# EAGLE schematic SLB_EXT_EAGLE (EAGLE 9.6.2), part 2 of 2
## Sheet 11 of 14: Equiv to Page 23 of 27 of Longboard_32bit_ext_Schematic_B9_FULL_PLACE.PDF
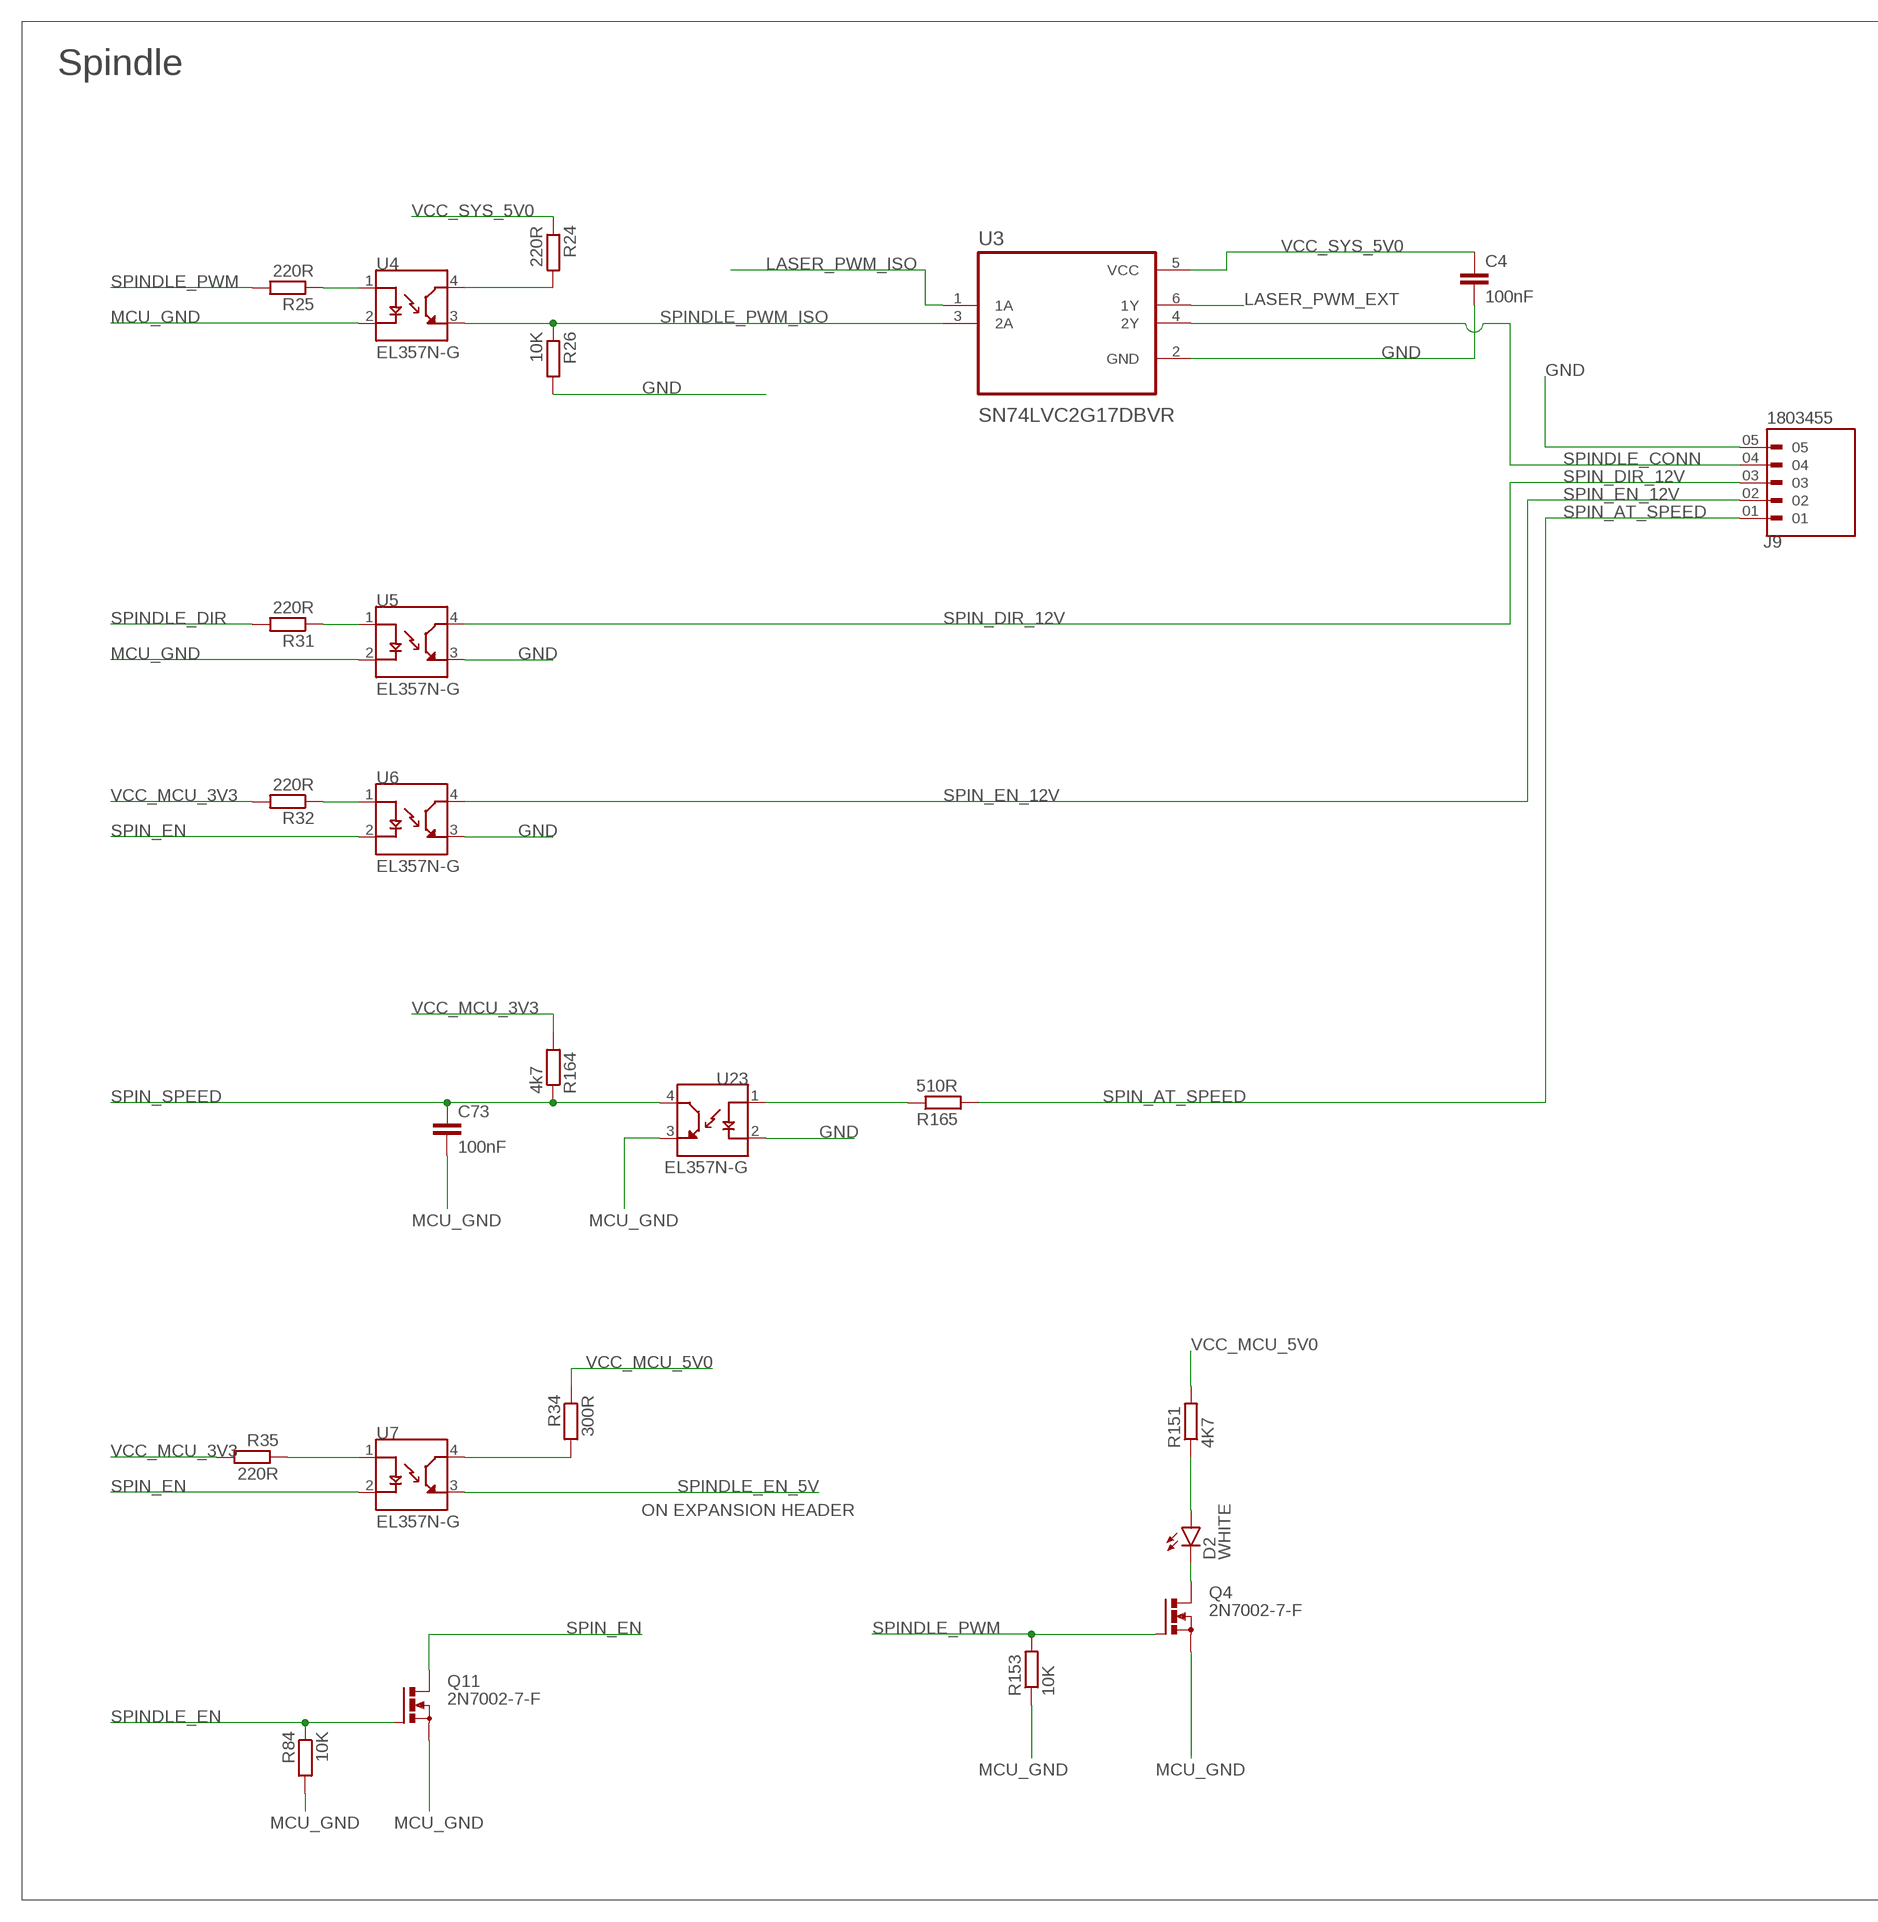
[diagram p12: schematic, sheet 11, part 1 of 2]
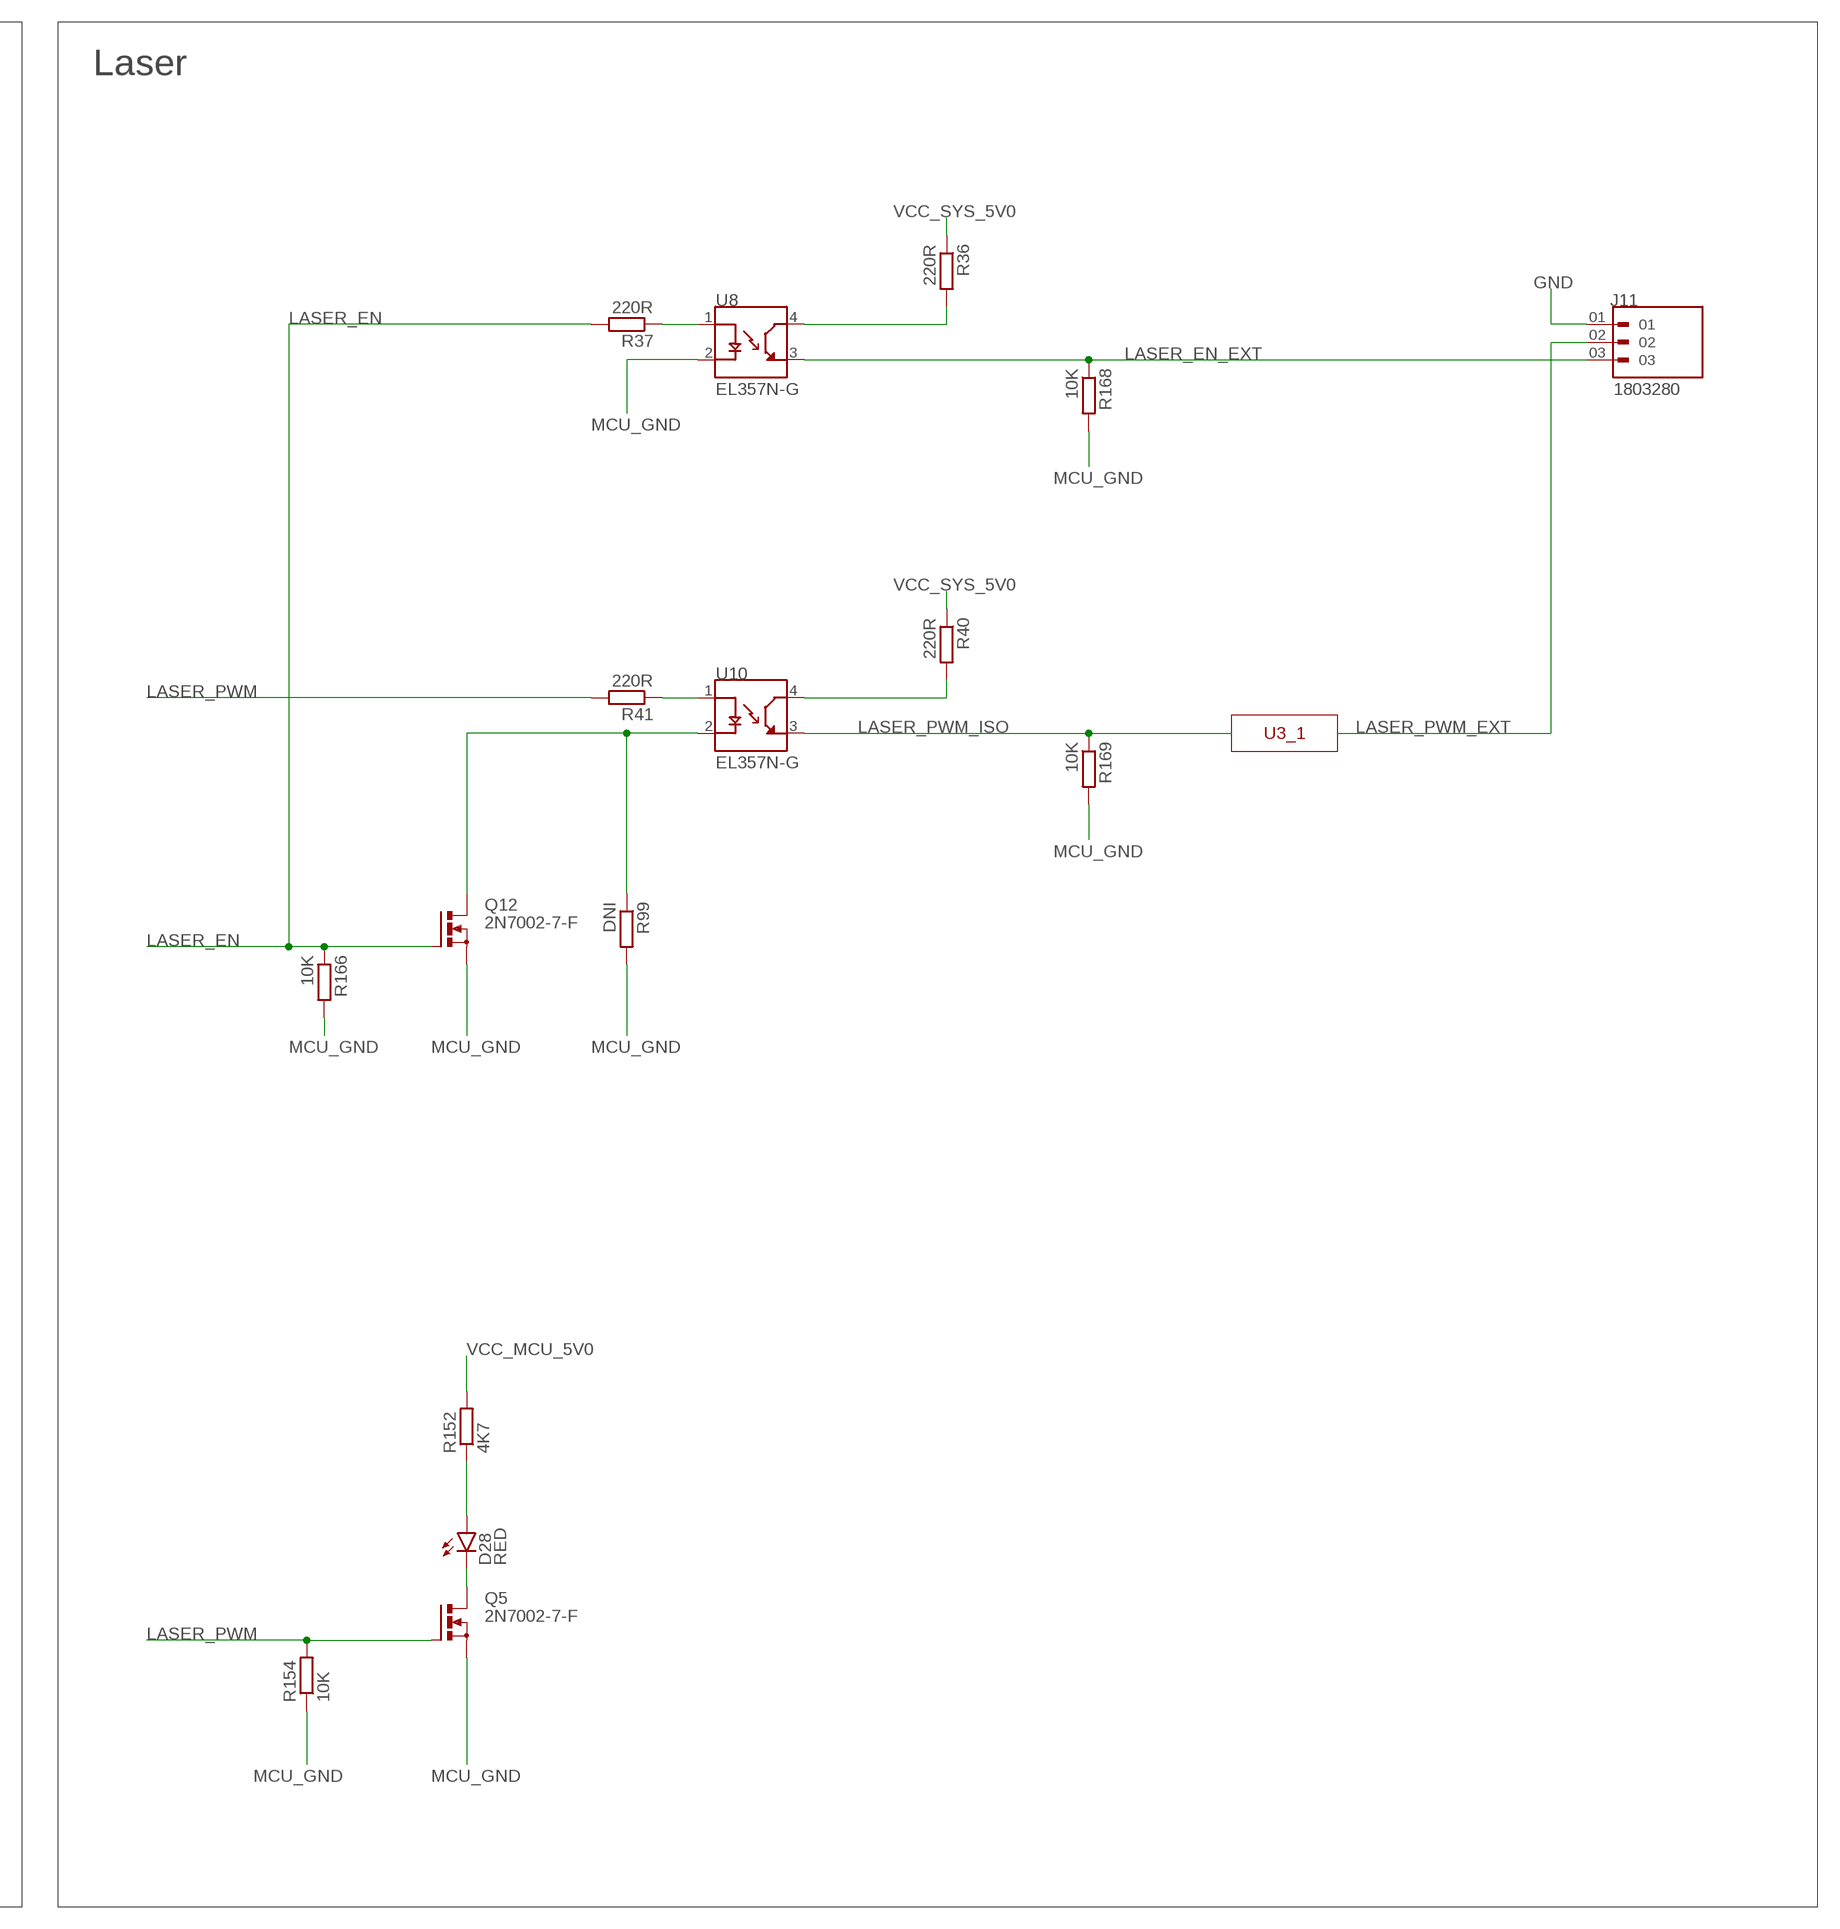
[diagram p13: schematic, sheet 11, part 2 of 2]

### Parts
C4  100nF  C-EUC0603  [C0603]
C73  100nF  C-EUC0603  [C0603]
D2  WHITE  LEDCHIP-LED0603  [CHIP-LED0603]
D28  RED  LEDCHIP-LED0603  [CHIP-LED0603]
J9  1803455  [PHOENIX_1803455]
J11  1803280  [PHOENIX_1803280]
Q4  2N7002-7-F  [SOT-23]
Q5  2N7002-7-F  [SOT-23]
Q11  2N7002-7-F  [SOT-23]
Q12  2N7002-7-F  [SOT-23]
R24  220R  R-EU_R0402  [R0402]
R25  220R  R-EU_R0402  [R0402]
R26  10K  R-EU_R0402  [R0402]
R31  220R  R-EU_R0402  [R0402]
R32  220R  R-EU_R0402  [R0402]
R34  300R  R-EU_R0402  [R0402]
R35  220R  R-EU_R0402  [R0402]
R36  220R  R-EU_R0402  [R0402]
R37  220R  R-EU_R0402  [R0402]
R40  220R  R-EU_R0402  [R0402]
R41  220R  R-EU_R0402  [R0402]
R84  10K  R-EU_R0402  [R0402]
R99  DNI  R-EU_R0402  [R0402]
R151  4K7  R-EU_R0402  [R0402]
R152  4K7  R-EU_R0402  [R0402]
R153  10K  R-EU_R0402  [R0402]
R154  10K  R-EU_R0402  [R0402]
R164  4k7  R-EU_R0402  [R0402]
R165  510R  R-EU_R0402  [R0402]
R166  10K  R-EU_R0402  [R0402]
R168  10K  R-EU_R0402  [R0402]
R169  10K  R-EU_R0402  [R0402]
U3  SN74LVC2G17DBVR  [SOT95P280X145-6N]
U4  EL357N-G  [OPTO_EL357N-G]
U5  EL357N-G  [OPTO_EL357N-G]
U6  EL357N-G  [OPTO_EL357N-G]
U7  EL357N-G  [OPTO_EL357N-G]
U8  EL357N-G  [OPTO_EL357N-G]
U10  EL357N-G  [OPTO_EL357N-G]
U23  EL357N-G  [OPTO_EL357N-G]

### Nets
GND: C4.2 J9.05 J11.01 R26.2 U3.2(GND) U5.3(ET) U6.3(ET) U23.2(C) ; also sheet 4,5,6,7,8,9,10,12,14
LASER_EN: Q12.P1(G) R37.2 R166.1 ; also sheet 1,3
LASER_EN_EXT: J11.03 R168.1 U8.3(ET)
LASER_PWM: Q5.P1(G) R41.2 R154.2 ; also sheet 1,3
LASER_PWM_EXT: J11.02 U3.6(1Y)
LASER_PWM_ISO: R169.1 U3.1(1A) U10.3(ET)
MCU_GND: C73.2 Q4.P2(S) Q5.P2(S) Q11.P2(S) Q12.P2(S) R84.2 R99.2 R153.1 R154.1 R166.2 R168.2 R169.2 U4.2(C) U5.2(C) U8.2(C) U23.3(ET) ; also sheet 2,3,5,6,9,12,13,14
N$163: R25.1 U4.1(A)
N$164: R24.2 U4.4(CT)
N$165: R31.1 U5.1(A)
N$166: R165.1 U23.1(A)
N$167: R32.1 U6.1(A)
N$168: R34.2 U7.4(CT)
N$169: D2.A R151.1
N$170: R35.1 U7.1(A)
N$171: D2.C Q4.P3(D)
N$172: D28.A R152.1
N$173: D28.C Q5.P3(D)
N$174: R41.1 U10.1(A)
N$175: Q12.P3(D) R99.1 U10.2(C)
N$176: R37.1 U8.1(A)
N$177: R36.2 U8.4(CT)
N$178: R40.2 U10.4(CT)
SPIN_AT_SPEED: J9.01 R165.2
SPIN_DIR_12V: J9.03 U5.4(CT)
SPIN_EN: Q11.P3(D) U6.2(C) U7.2(C)
SPIN_EN_12V: J9.02 U6.4(CT)
SPIN_SPEED: C73.1 R164.1 U23.4(CT) ; also sheet 3
SPINDLE_CONN: J9.04 U3.4(2Y)
SPINDLE_DIR: R31.2 ; also sheet 3
SPINDLE_EN: Q11.P1(G) R84.1 ; also sheet 3
SPINDLE_EN_5V: U7.3(ET) ; also sheet 6
SPINDLE_PWM: Q4.P1(G) R25.2 R153.2 ; also sheet 3
SPINDLE_PWM_ISO: R26.1 U3.3(2A) U4.3(ET)
VCC_MCU_3V3: R32.2 R35.2 R164.2 ; also sheet 2,3,4,5,6,7,8,9,12,14
VCC_MCU_5V0: R34.1 R151.2 R152.2 ; also sheet 6,9,12
VCC_SYS_5V0: C4.1 R24.1 R36.1 R40.1 U3.5(VCC) ; also sheet 5,6,7,8,9,10,14

### Notes on the sheet
- Equiv to Page 23/27 of Longboard_32bit_ext_Schematic_B9_FULL_PLACE.PDF
- Spindle | Laser
- U3_1
- ON EXPANSION HEADER

## Sheet 12 of 14: Equiv to Page 24 of 27 of Longboard_32bit_ext_Schematic_B9_FULL_PLACE.PDF
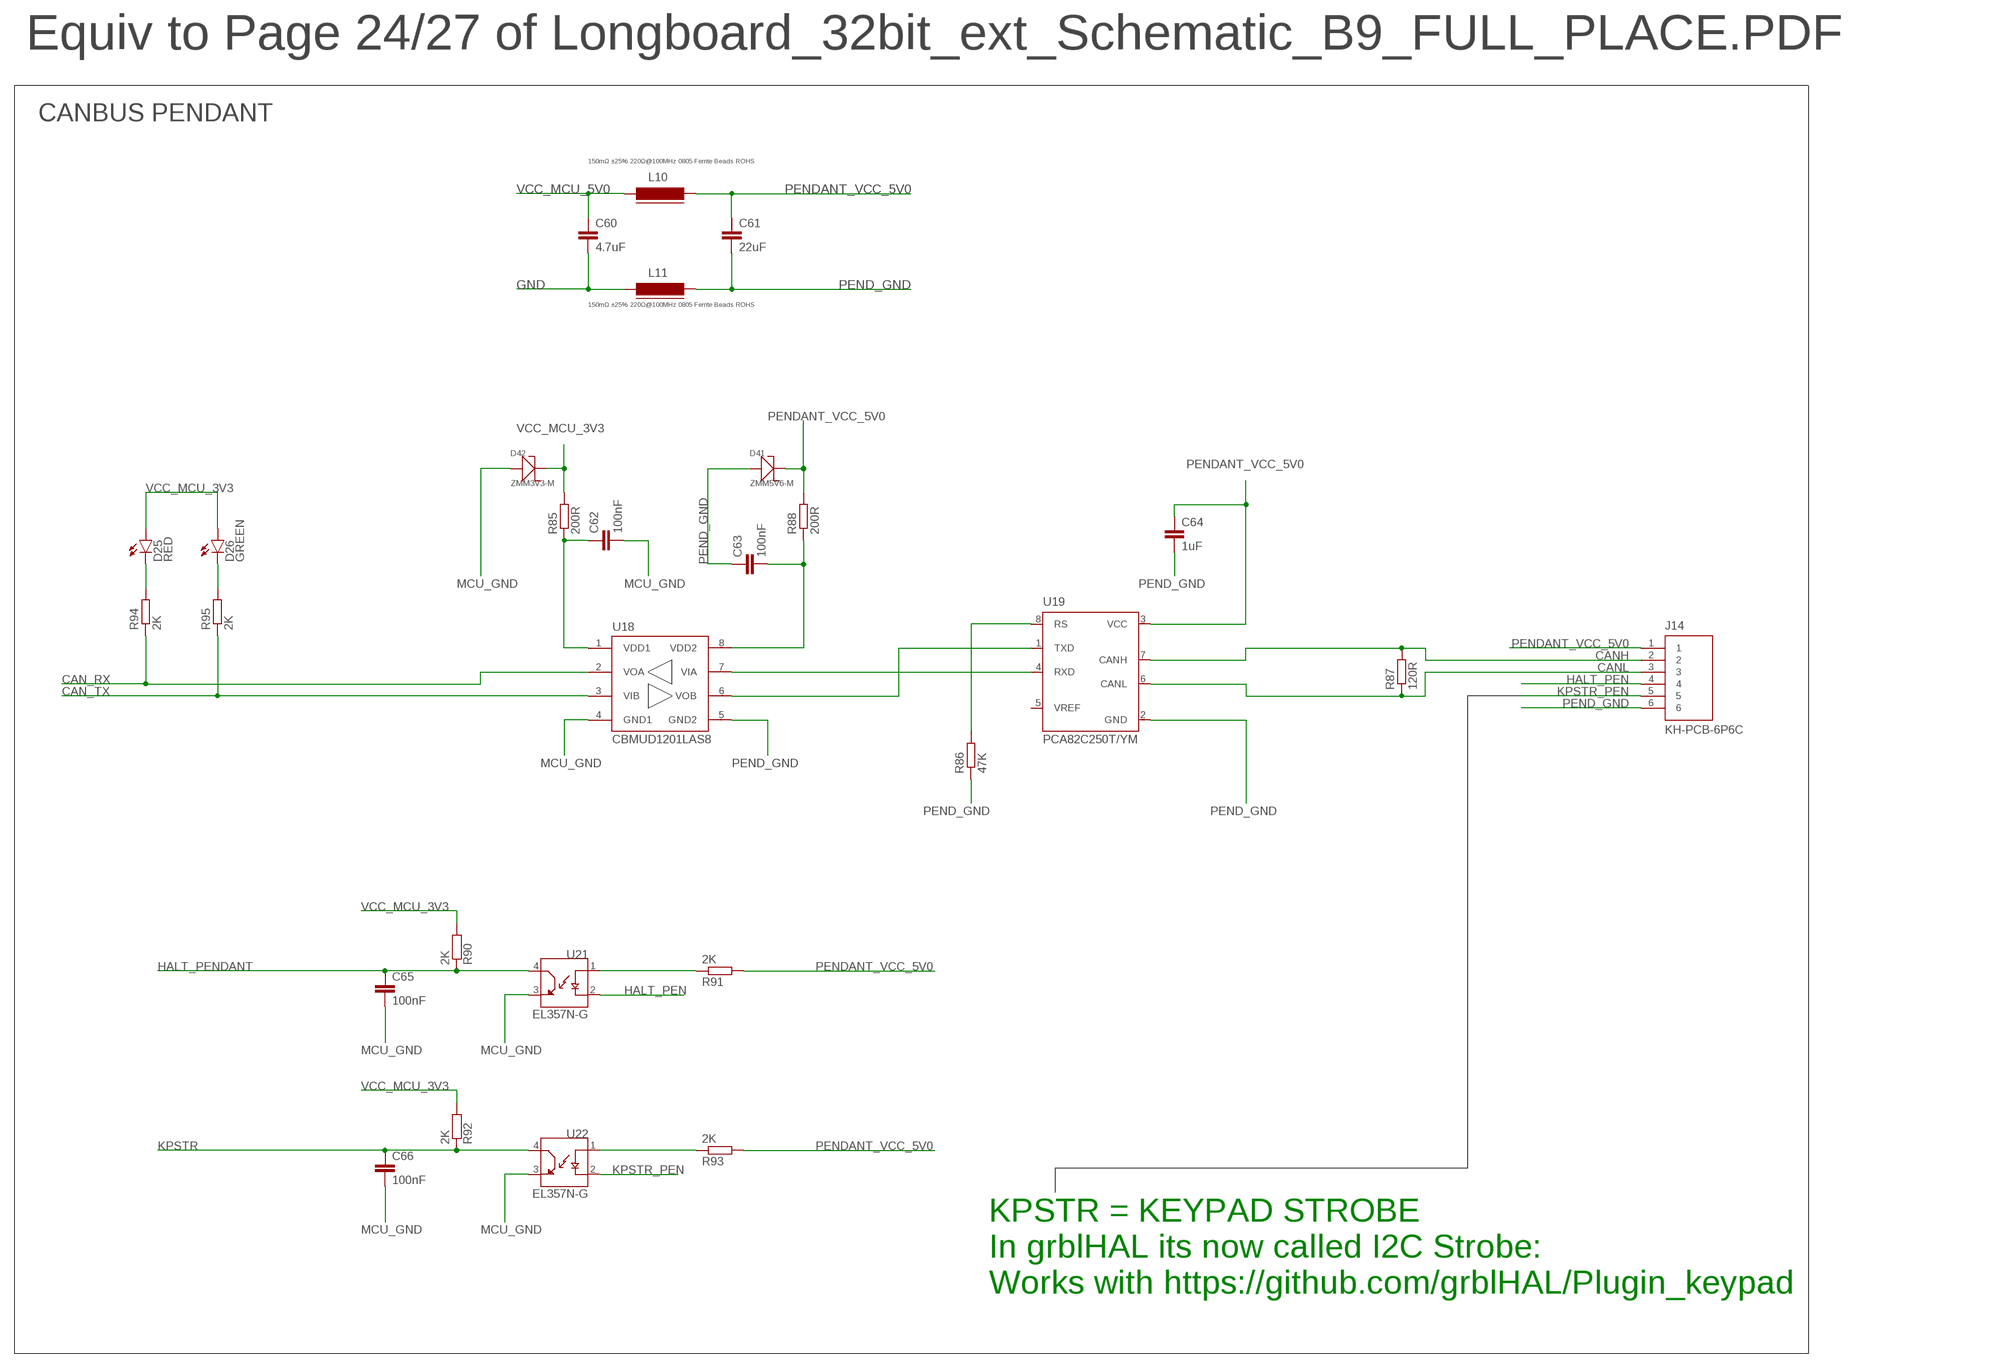
[diagram p14: schematic, sheet 12]

### Parts
C60  4.7uF  C-EUC0603  [C0603]
C61  22uF  C-EUC0603  [C0603]
C62  100nF  C-EUC0603  [C0603]
C63  100nF  C-EUC0603  [C0603]
C64  1uF  C-EUC0603  [C0603]
C65  100nF  C-EUC0603  [C0603]
C66  100nF  C-EUC0603  [C0603]
D25  RED  LEDCHIP-LED0603  [CHIP-LED0603]
D26  GREEN  LEDCHIP-LED0603  [CHIP-LED0603]
D41  ZMM5V6-M  ZMM3V3-M  [LL-34]
D42  ZMM3V3-M  [LL-34]
J14  KH-PCB-6P6C  [KH-PCB-6P6C]
L10  150mΩ ±25% 220Ω@100MHz 0805 Ferrite Beads ROHS  FERRITE-0805  [FB805]
L11  150mΩ ±25% 220Ω@100MHz 0805 Ferrite Beads ROHS  FERRITE-0805  [FB805]
R85  200R  R-EU_R0402  [R0402]
R86  47K  R-EU_R0402  [R0402]
R87  120R  R-EU_R0402  [R0402]
R88  200R  R-EU_R0402  [R0402]
R90  2K  R-EU_R0402  [R0402]
R91  2K  R-EU_R0402  [R0402]
R92  2K  R-EU_R0402  [R0402]
R93  2K  R-EU_R0402  [R0402]
R94  2K  R-EU_R0402  [R0402]
R95  2K  R-EU_R0402  [R0402]
U18  CBMUD1201LAS8  [SOIC-8]
U19  PCA82C250T/YM  PCA82C250T  [SO8]
U21  EL357N-G  [OPTO_EL357N-G]
U22  EL357N-G  [OPTO_EL357N-G]

### Nets
CAN_RX: R94.1 U18.2(VOA) ; also sheet 1,3
CAN_TX: R95.1 U18.3(VIB) ; also sheet 1,3
CANH: J14.2 R87.2 U19.7(CANH)
CANL: J14.3 R87.1 U19.6(CANL)
GND: C60.2 L11.1 ; also sheet 4,5,6,7,8,9,10,11,14
HALT_PEN: J14.4 U21.2(C)
HALT_PENDANT: C65.1 R90.1 U21.4(CT) ; also sheet 1,2
KPSTR: C66.1 R92.1 U22.4(CT) ; also sheet 6
KPSTR_PEN: J14.5 U22.2(C)
MCU_GND: C62.2 C65.2 C66.2 D42.A(+) U18.4(GND1) U21.3(ET) U22.3(ET) ; also sheet 2,3,5,6,9,11,13,14
N$179: D25.C R94.2
N$180: D26.C R95.2
N$181: C62.1 R85.1 U18.1(VDD1)
N$182: U18.7(VIA) U19.4(RXD)
N$183: U18.6(VOB) U19.1(TXD)
N$184: C63.2 R88.1 U18.8(VDD2)
N$185: R86.2 U19.8(RS)
N$186: R91.1 U21.1(A)
N$187: R93.1 U22.1(A)
PEND_GND: C61.2 C63.1 C64.2 D41.A(+) J14.6 L11.2 R86.1 U18.5(GND2) U19.2(GND) ; also sheet 14
PENDANT_VCC_5V0: C61.1 C64.1 D41.C(-) J14.1 L10.2 R88.2 R91.2 R93.2 U19.3(VCC)
VCC_MCU_3V3: D25.A D26.A D42.C(-) R85.2 R90.2 R92.2 ; also sheet 2,3,4,5,6,7,8,9,11,14
VCC_MCU_5V0: C60.1 L10.1 ; also sheet 6,9,11
Unconnected: U19.5(VREF)

### Notes on the sheet
- Equiv to Page 24/27 of Longboard_32bit_ext_Schematic_B9_FULL_PLACE.PDF
- CANBUS PENDANT
- KPSTR = KEYPAD STROBE 
  In grblHAL its now called I2C Strobe: 
  Works with https://github.com/grblHAL/Plugin_keypad

## Sheet 13 of 14: Equiv to Page 25 of 27 of Longboard_32bit_ext_Schematic_B9_FULL_PLACE.PDF
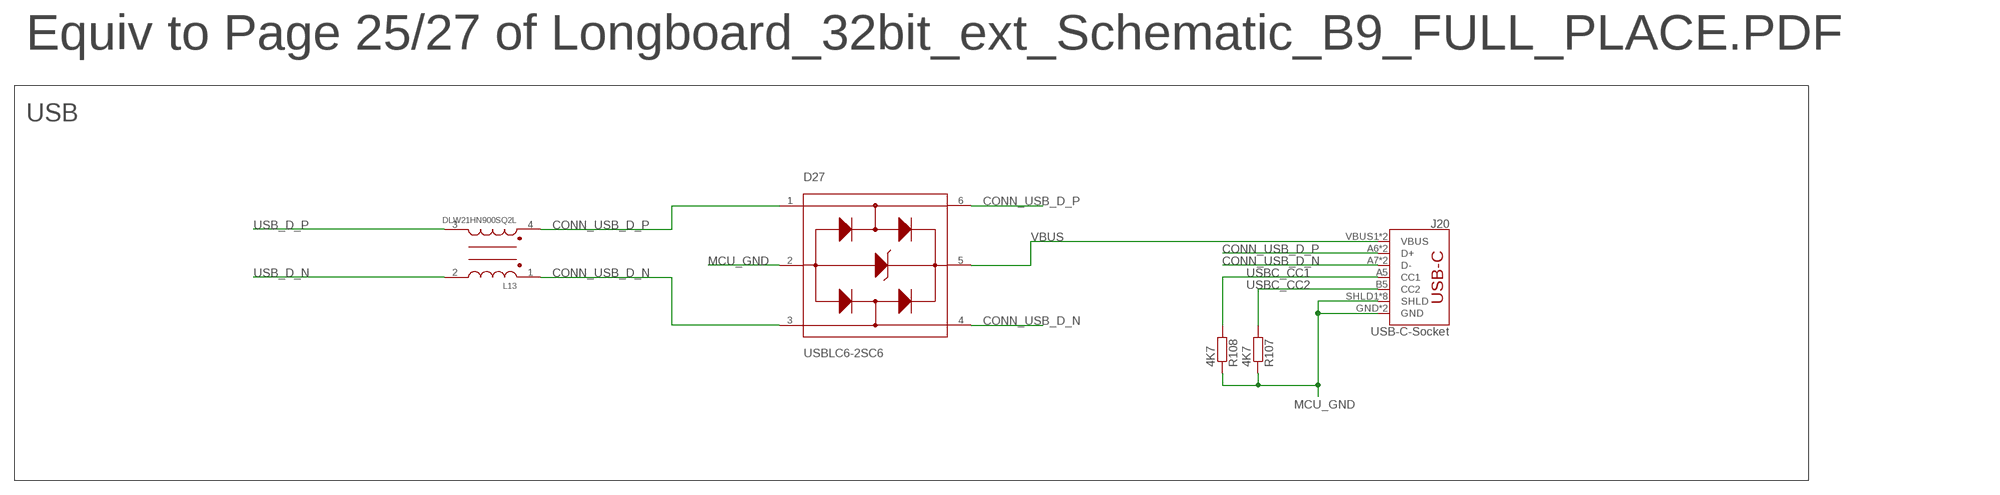
[diagram p15: schematic, sheet 13]

### Parts
D27  USBLC6-2SC6  [SOT95P280X145-6N]
J20  USB-C-Socket  USB_C16PIN  [USB-C-16P]
L13  DLW21HN900SQ2L  [FIL_DLW21HN900SQ2L]
R107  4K7  R-EU_R0402  [R0402]
R108  4K7  R-EU_R0402  [R0402]

### Nets
CONN_USB_D_N: D27.3(I/O2_IN) D27.4(I/O2_OUT) J20.A7(D-) J20.B7(D-) L13.1
CONN_USB_D_P: D27.1(I/O1_IN) D27.6(I/O1_OUT) J20.A6(D+) J20.B6(D+) L13.4
MCU_GND: D27.2(GND) J20.GND J20.GND2(GND) J20.SHLD1(SHLD) J20.SHLD2(SHLD) J20.SHLD3(SHLD) J20.SHLD4(SHLD) J20.SHLD5(SHLD) J20.SHLD6(SHLD) J20.SHLD7(SHLD) J20.SHLD8(SHLD) R107.1 R108.1 ; also sheet 2,3,5,6,9,11,12,14
USB_D_N: L13.2 ; also sheet 3
USB_D_P: L13.3 ; also sheet 3
USBC_CC1: J20.A5(CC1) R108.2
USBC_CC2: J20.B5(CC2) R107.2
VBUS: D27.5(VBUS) J20.VBUS1(VBUS) J20.VBUS2(VBUS)

### Notes on the sheet
- Equiv to Page 25/27 of Longboard_32bit_ext_Schematic_B9_FULL_PLACE.PDF
- USB

## Sheet 14 of 14: Equiv to Page 26 of 27 of Longboard_32bit_ext_Schematic_B9_FULL_PLACE.PDF
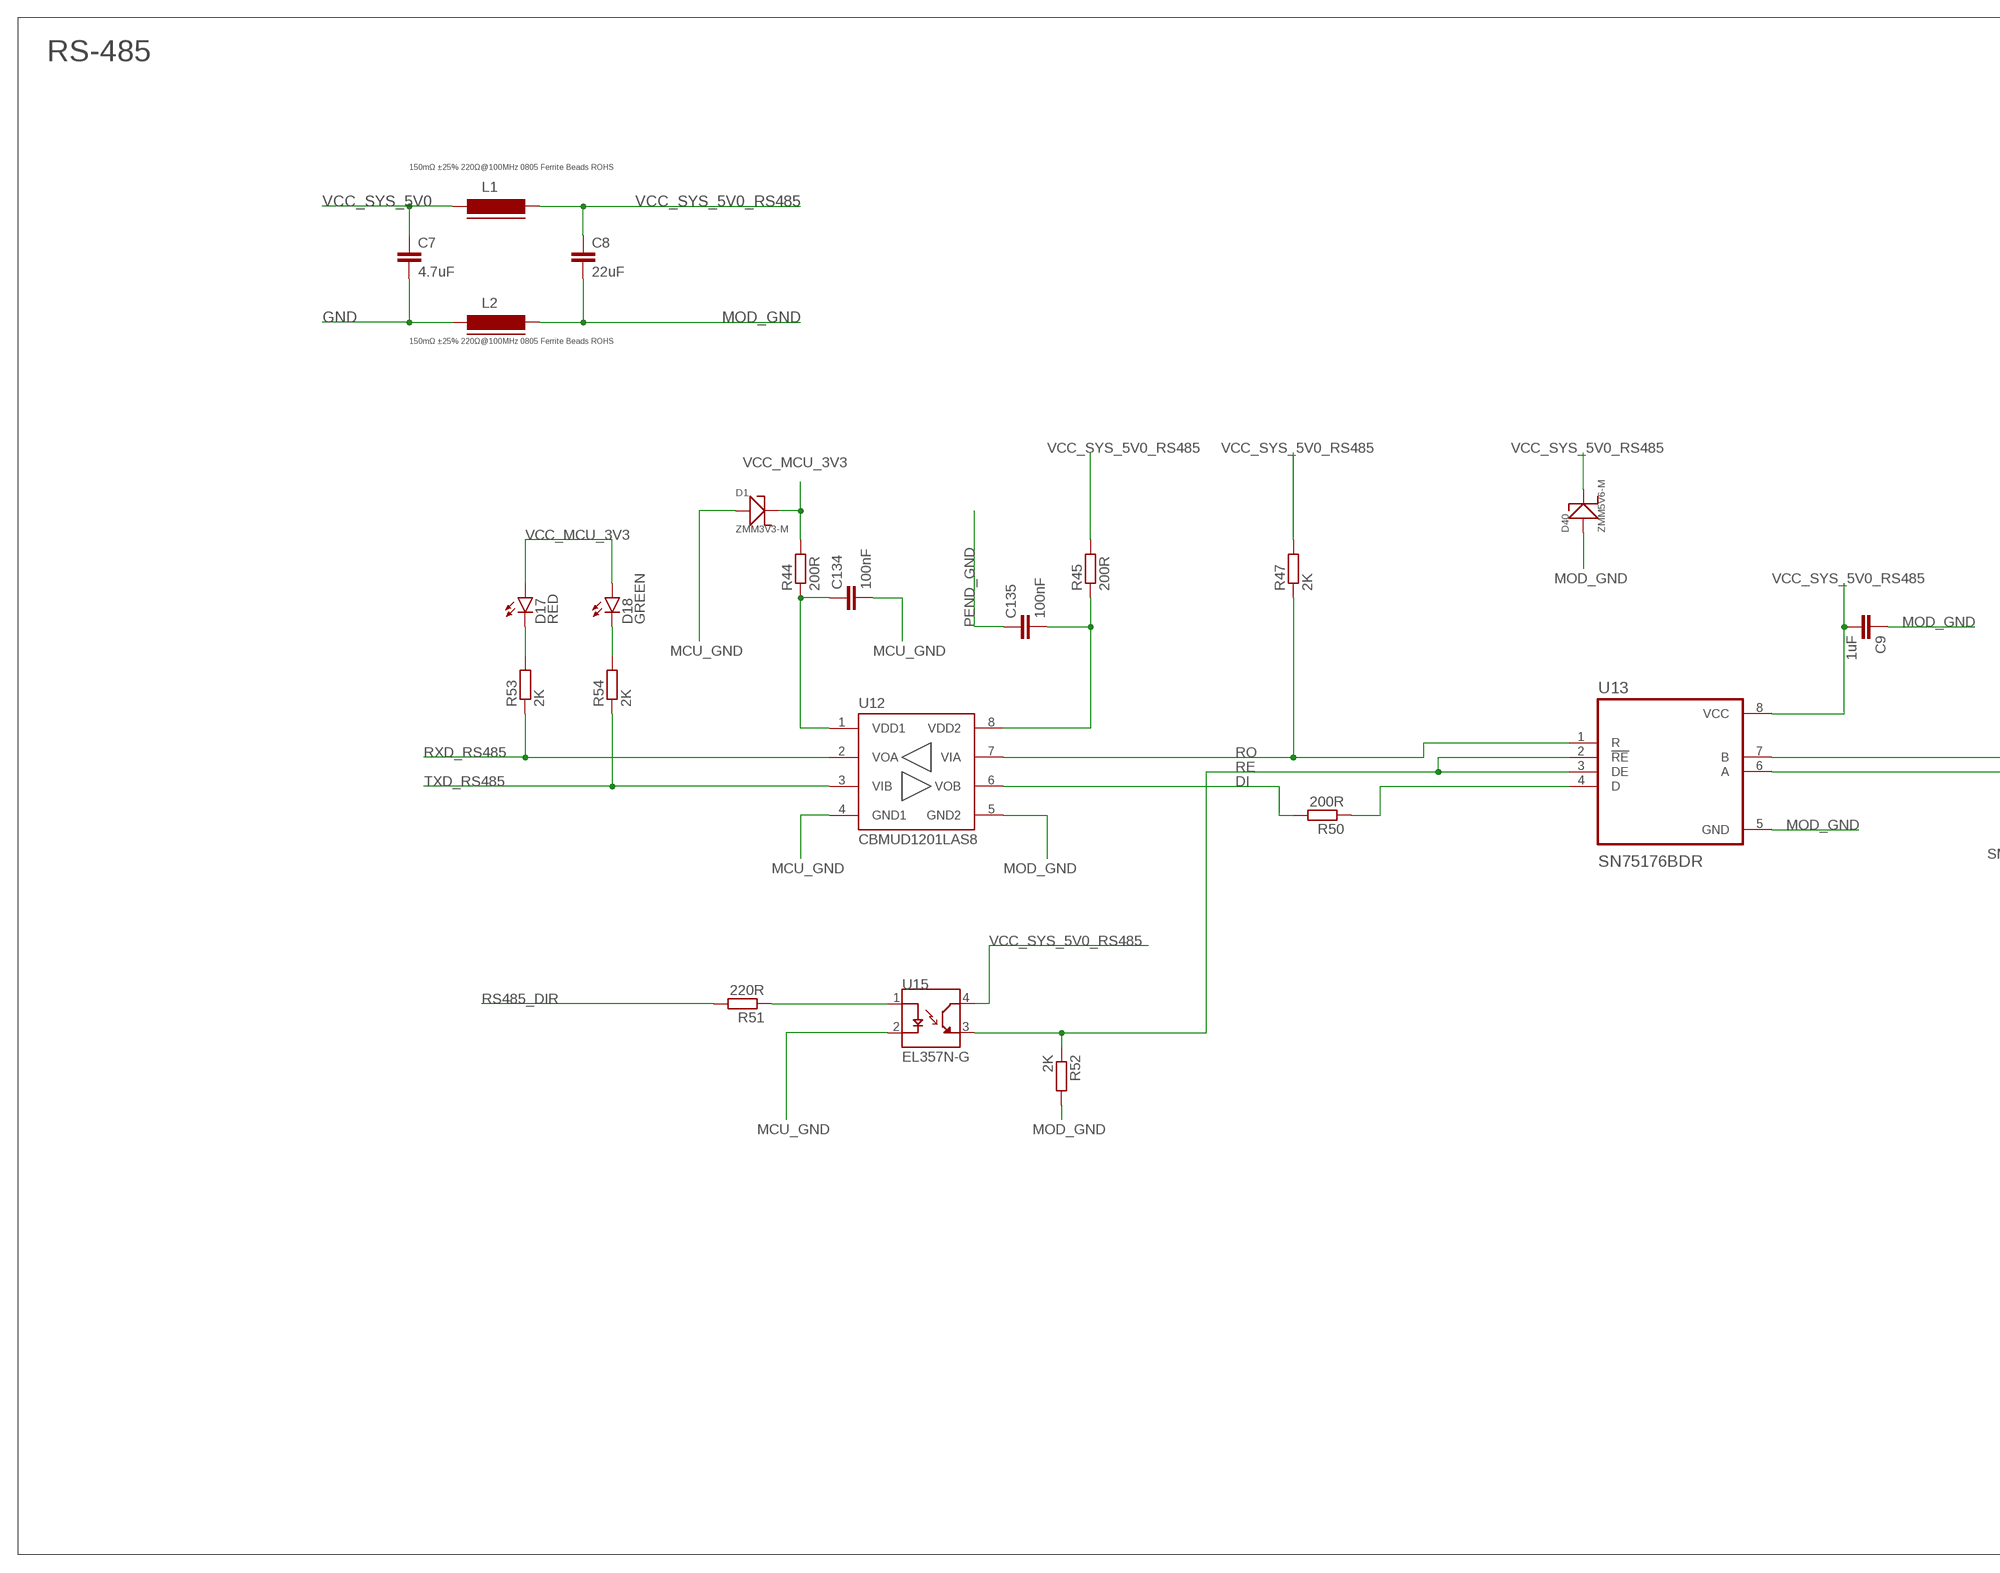
[diagram p16: schematic, sheet 14, part 1 of 2]
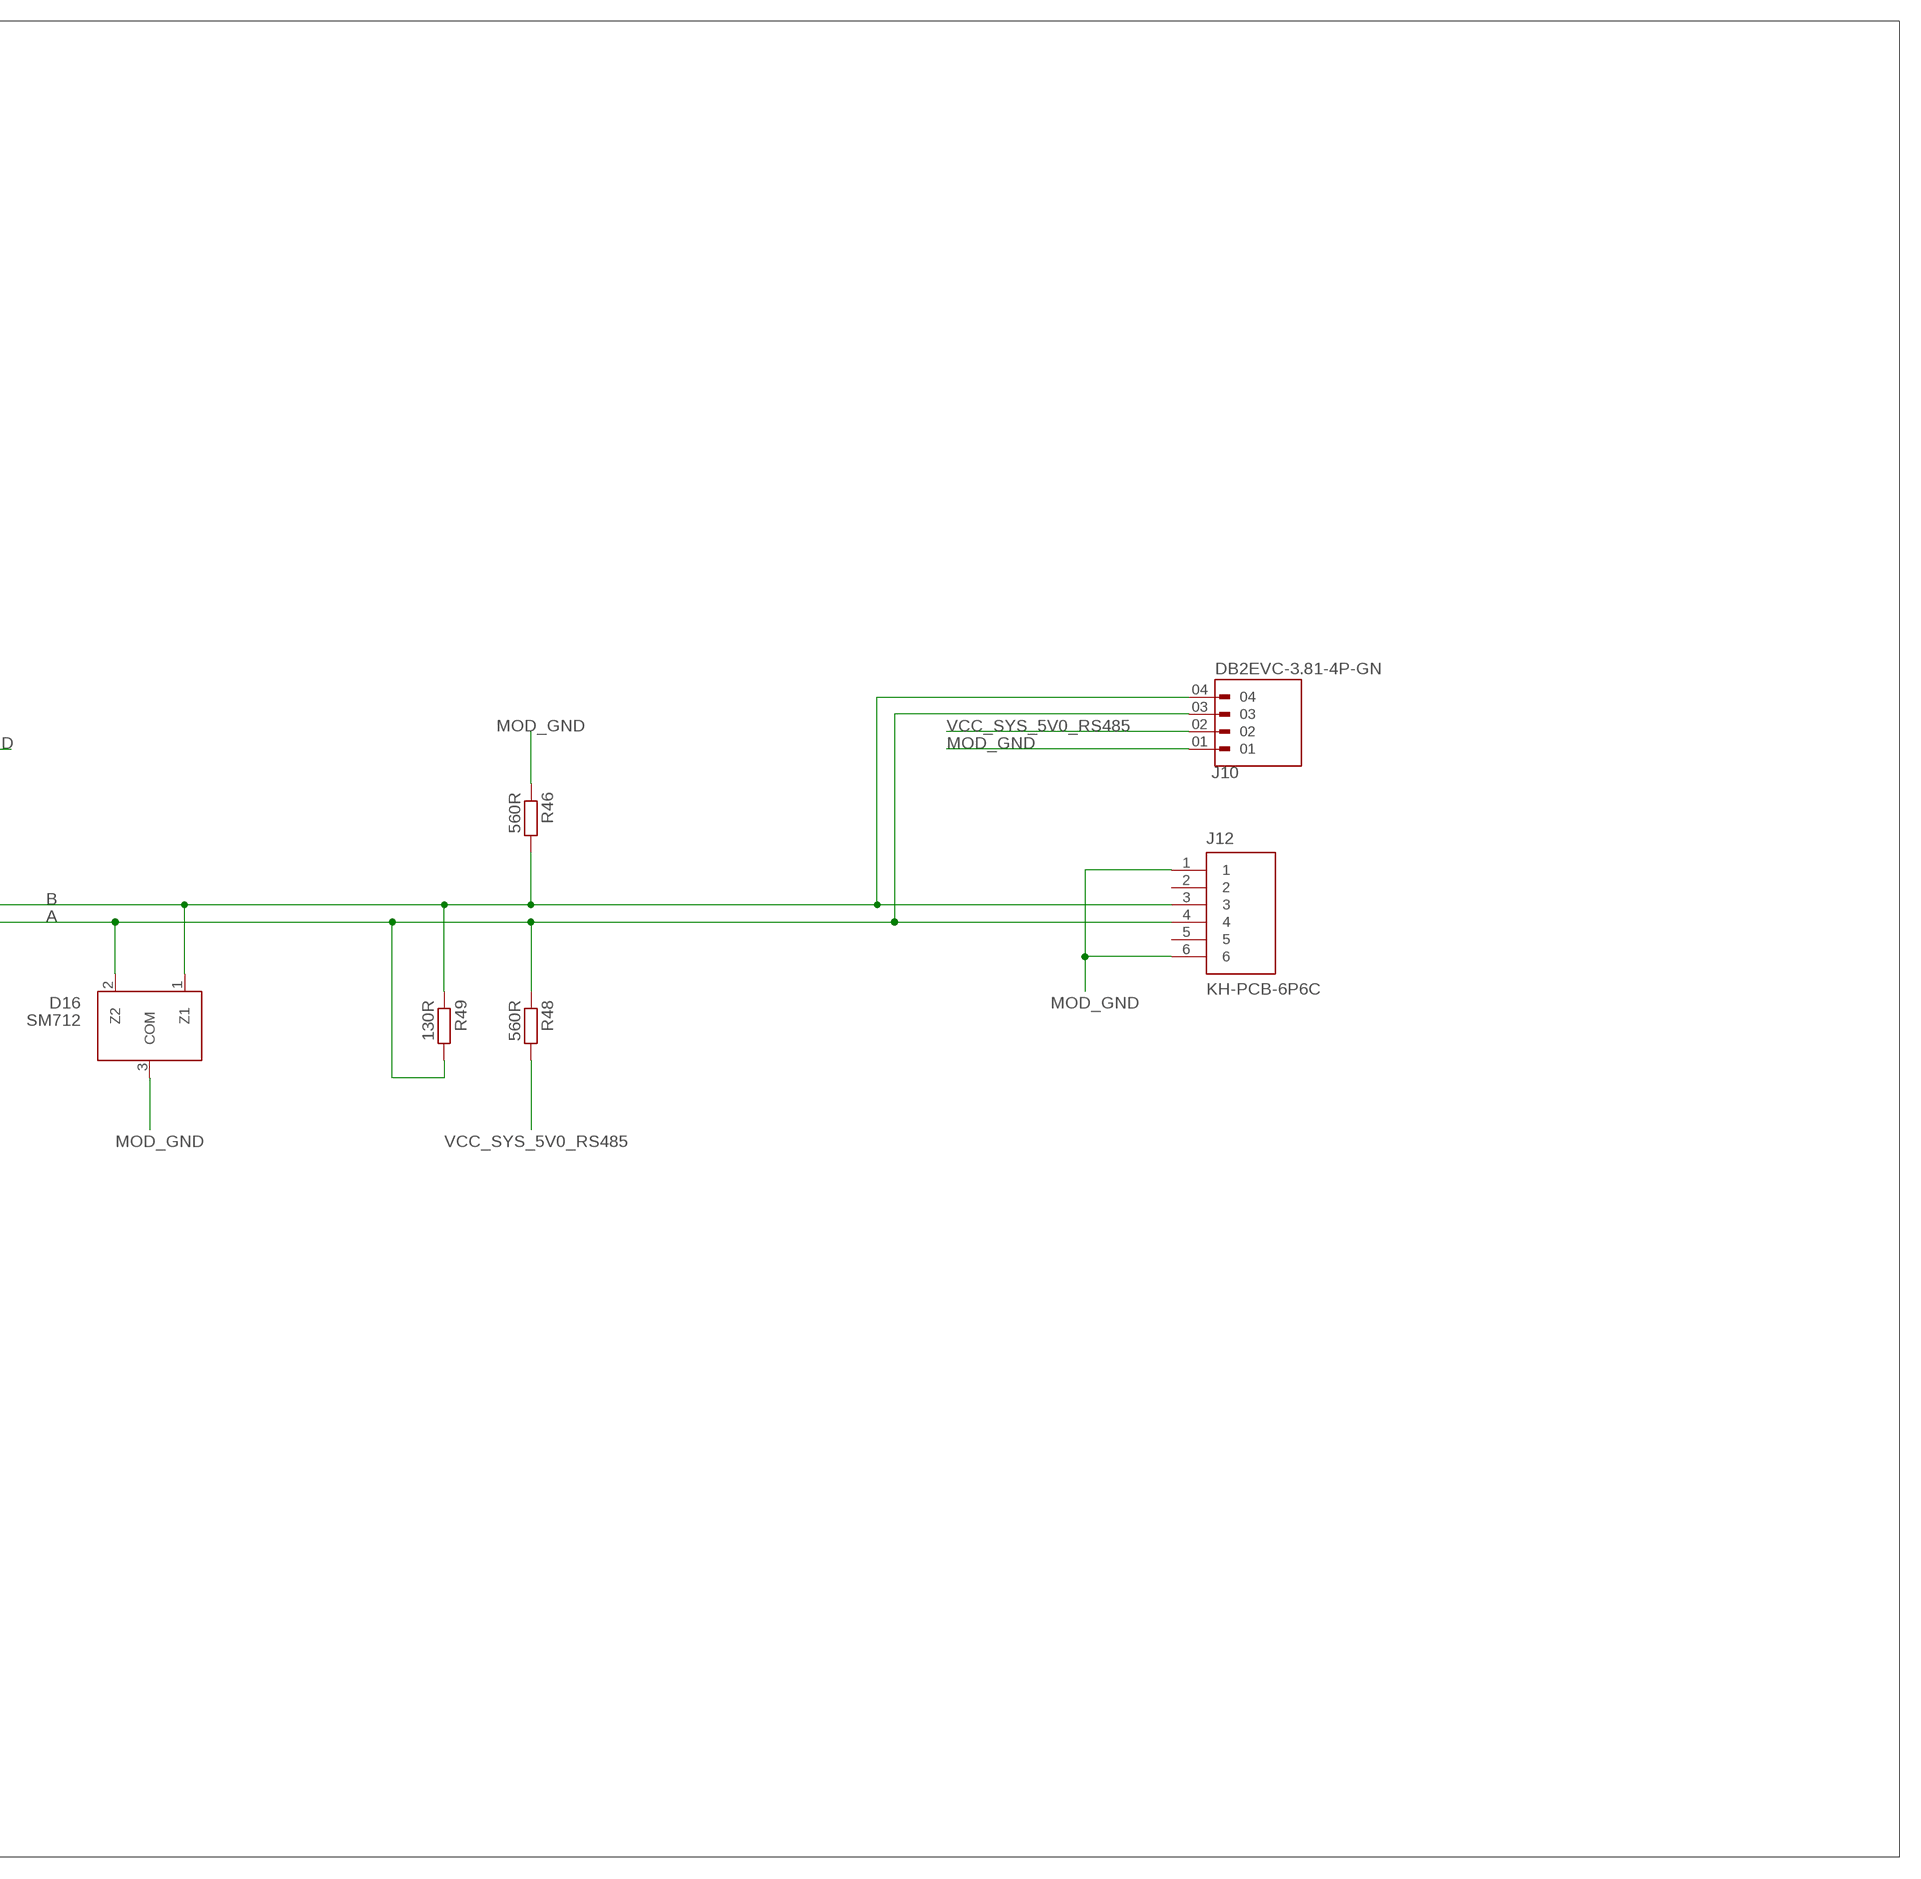
[diagram p17: schematic, sheet 14, part 2 of 2]

### Parts
C7  4.7uF  C-EUC0603  [C0603]
C8  22uF  C-EUC0603  [C0603]
C9  1uF  C-EUC0603  [C0603]
C134  100nF  C-EUC0603  [C0603]
C135  100nF  C-EUC0603  [C0603]
D1  ZMM3V3-M  [LL-34]
D16  SM712  [SOT23]
D17  RED  LEDCHIP-LED0603  [CHIP-LED0603]
D18  GREEN  LEDCHIP-LED0603  [CHIP-LED0603]
D40  ZMM5V6-M  ZMM3V3-M  [LL-34]
J10  DB2EVC-3.81-4P-GN  [DB2EVC-3.81-4P-GN]
J12  KH-PCB-6P6C  [KH-PCB-6P6C]
L1  150mΩ ±25% 220Ω@100MHz 0805 Ferrite Beads ROHS  FERRITE-0805  [FB805]
L2  150mΩ ±25% 220Ω@100MHz 0805 Ferrite Beads ROHS  FERRITE-0805  [FB805]
R44  200R  R-EU_R0402  [R0402]
R45  200R  R-EU_R0402  [R0402]
R46  560R  R-EU_R0402  [R0402]
R47  2K  R-EU_R0402  [R0402]
R48  560R  R-EU_R0402  [R0402]
R49  130R  R-EU_R0402  [R0402]
R50  200R  R-EU_R0402  [R0402]
R51  220R  R-EU_R0402  [R0402]
R52  2K  R-EU_R0402  [R0402]
R53  2K  R-EU_R0402  [R0402]
R54  2K  R-EU_R0402  [R0402]
U12  CBMUD1201LAS8  [SOIC-8]
U13  SN75176BDR  [SOIC127P599X175-8N]
U15  EL357N-G  [OPTO_EL357N-G]

### Nets
A: D16.2(Z2) J10.03 J12.4 R48.1 R49.2 U13.6(A)
B: D16.1(Z1) J10.04 J12.3 R46.2 R49.1 U13.7(B)
DI: R50.2 U12.6(VOB)
GND: C7.2 L2.1 ; also sheet 4,5,6,7,8,9,10,11,12
MCU_GND: C134.2 D1.A(+) U12.4(GND1) U15.2(C) ; also sheet 2,3,5,6,9,11,12,13
MOD_GND: C8.2 C9.1 D16.3(COM) D40.A(+) J10.01 J12.1 J12.6 L2.2 R46.1 R52.2 U12.5(GND2) U13.5(GND)
N$188: C134.1 R44.1 U12.1(VDD1)
N$189: C135.2 R45.1 U12.8(VDD2)
N$190: R50.1 U13.4(D)
N$192: R51.1 U15.1(A)
N$193: D17.C R53.2
N$194: D18.C R54.2
PEND_GND: C135.1 ; also sheet 12
RE: R52.1 U13.2(!RE) U13.3(DE) U15.3(ET)
RO: R47.1 U12.7(VIA) U13.1(R)
RS485_DIR: R51.2 ; also sheet 3
RXD_RS485: R53.1 U12.2(VOA) ; also sheet 3
TXD_RS485: R54.1 U12.3(VIB) ; also sheet 3
VCC_MCU_3V3: D1.C(-) D17.A D18.A R44.2 ; also sheet 2,3,4,5,6,7,8,9,11,12
VCC_SYS_5V0: C7.1 L1.1 ; also sheet 5,6,7,8,9,10,11
VCC_SYS_5V0_RS485: C8.1 C9.2 D40.C(-) J10.02 L1.2 R45.2 R47.2 R48.2 U13.8(VCC) U15.4(CT)
Unconnected: J12.2 J12.5

### Notes on the sheet
- Equiv to Page 26/27 of Longboard_32bit_ext_Schematic_B9_FULL_PLACE.PDF
- RS-485

## Library data of the parts
C1 C2 C3_AL C3_CY C3_DR C3_HL C3_MC1 C3_MC2 C3_PRB C3_TLO C3_XL C3_Y1L C3_Y2L C3_ZL C5-C7 C20-C51 C54 C60 C67 C68 C70-C72 C77-C80 C82 C89 C90 C95-C97 C100-C102 C107_N0 C107_N1-C107_N3 C109-C112 C114 C116-C133 C136-C138 = rcl:C-EU: CAPACITOR, European symbol; SPICEPREFIX: C
C4 C8-C19 C52 C53 C55 C58 C59 C61-C66 C69 C73-C76 C81 C83-C88 C91-C94 C99 C103-C106 C108 C113 C115 C134 C135 C139-C145 = rcl:C-EU: CAPACITOR, European symbol; LCSC_PART: C576517; SPICEPREFIX: C
C56 = 3528 Capacitor Tantulum:C-3528: Check availability <https://pricing.snapeda.com/parts/T543B337K2R5AHW035/KEMET/view-part?ref=eda>; AVAILABILITY: In Stock; CHECK_PRICES: https://www.snapeda.com/parts/T543B337K2R5AHW035/KEMET/view-part/?ref=eda; DESCRIPTION: Cap Tant Polymer 330uF 2.5VDC B CASE 10% (3.5 X 2.8 X 1.9mm) SMD 3528-21 0.035 Ohm 105°C T/R; MF: KEMET; MP: T543B337K2R5AHW035; PACKAGE: SMD-2 Kemet; PRICE: None; SNAPEDA_LINK: https://www.snapeda.com/parts/T543B337K2R5AHW035/KEMET/view-part/?ref=snap
C57 = rcl:CPOL-US: POLARIZED CAPACITOR, American symbol; SPICEPREFIX: C
C98 = vovtech:CAP: Capacitor
D1 D40-D42 = ZMM3V3-M:ZMM3V3-M: Check availability <https://pricing.snapeda.com/parts/LL4148ST/STMicroelectronics/view-part?ref=eda>; AVAILABILITY: In Stock; CHECK_PRICES: https://www.snapeda.com/parts/LL4148ST/STMicroelectronics/view-part/?ref=eda; DESCRIPTION: SMD Diode Switching 75V-200mA; LL-34; MF: STMicroelectronics; MP: LL4148ST; PACKAGE: None; PRICE: None; SNAPEDA_LINK: https://www.snapeda.com/parts/LL4148ST/STMicroelectronics/view-part/?ref=snap
D2-D13 D15_TR1 D15_TR2 D17 D18 D20 D24-D26 D28 D29 D32-D34 D37-D39 D43_RL1 D43_RL2 D51 D52 D57-D64 = led:LED: LED OSRAM: - CHIPLED LG R971, LG N971, LY N971, LG Q971, LY Q971, LO R971, LY R971 LH N974, LH R974 LS Q976, LO Q976, LY Q976 LO Q996 - Hyper CHIPLED LW Q18S LB Q993, LB Q99A, LB R99A - SideLED LS A670, LO A670, LY A670, LG A670, LP A670 LB A673, LV A673, LT A673, LW A673 LH A674 LY A675 LS A676, LA A676, LO A676, LY A676, LW A676 LS A679, LY A679, LG A679 - Hyper Micro SIDELED® LS Y876, LA Y876, LO Y876, LY Y876 LT Y87S - SmartLED LW L88C, LW L88S LB L89C, LB L89S, LG L890 LS L89K, LO L89K, LY L89K LS L896, LA L896, LO L896, LY L896 - TOPLED LS T670, LO T670, LY T670, LG T670, LP T670 LSG T670, LSP T670, LSY T670, LOP T670, LYG T670 LG T671, LOG T671, LSG T671 LB T673, LV T673, LT T673, LW T673 LH T674 LS T676, LA T676, LO T676, LY T676, LB T676, LH T676, LSB T676, LW T676 LB T67C, LV T67C, LT T67C, LS T67K, LO T67K, LY T67K, LW E67C LS E67B, LA E67B, LO E67B, LY E67B, LB E67C, LV E67C, LT E67C LW T67C LS T679, LY T679, LG T679 LS T770, LO T770, LY T770, LG T770, LP T770 LB T773, LV T773, LT T773, LW T773 LH T774 LS E675, LA E675, LY E675, LS T675 LS T776, LA T776, LO T776, LY T776, LB T776 LHGB T686 LT T68C, LB T68C - Hyper Mini TOPLED® LB M676 - Mini TOPLED Santana® LG M470 LS M47K, LO M47K, LY M47K Source: http://www.osram.convergy.de LUXEON: - LUMILED® LXK2-PW12-R00, LXK2-PW12-S00, LXK2-PW14-U00, LXK2-PW14-V00 LXK2-PM12-R00, LXK2-PM12-S00, LXK2-PM14-U00 LXK2-PE12-Q00, LXK2-PE12-R00, LXK2-PE12-S00, LXK2-PE14-T00, LXK2-PE14-U00 LXK2-PB12-K00, LXK2-PB12-L00, LXK2-PB12-M00, LXK2-PB14-N00, LXK2-PB14-P00, LXK2-PB14-Q00 LXK2-PR12-L00, LXK2-PR12-M00, LXK2-PR14-Q00, LXK2-PR14-R00 LXK2-PD12-Q00, LXK2-PD12-R00, LXK2-PD12-S00 LXK2-PH12-R00, LXK2-PH12-S00 LXK2-PL12-P00, LXK2-PL12-Q00, LXK2-PL12-R00 Source: www.luxeon.com KINGBRIGHT: KA-3528ASYC Source: www.kingbright.com
D14 D19 D45 D47 D48 = dp_devices.v6:DIODE: Various Diode Packages; LCSC_PART: C14996
D16 = SM712:SM712: Check availability <https://pricing.snapeda.com/parts/SM712/Semtech/view-part?ref=eda>; AVAILABILITY: Not in stock; CHECK_PRICES: https://www.snapeda.com/parts/SM712/Semtech/view-part/?ref=eda; DESCRIPTION: 26V, 12V Clamp 17A (8/20µs) Ipp Tvs Diode Surface Mount SOT-23-3; MF: Semtech; MP: SM712; PACKAGE: None; PRICE: None; SNAPEDA_LINK: https://www.snapeda.com/parts/SM712/Semtech/view-part/?ref=snap
D21 D22 D49 = ZENERdiode:DIODE-: DIODE
D23 = ZENER_SMAF:SMAF-ZDIODE: Check availability <https://pricing.snapeda.com/parts/1SMA5927BT3G/ON%20Semiconductor/view-part?ref=eda>; AVAILABILITY: In Stock; CHECK_PRICES: https://www.snapeda.com/parts/1SMA5927BT3G/Onsemi/view-part/?ref=eda; DESCRIPTION: Zener Diode 12 V 1.5 W ±5% Surface Mount SMA; MF: ON Semiconductor; MP: 1SMA5927BT3G; PACKAGE: SMA-2 ON Semiconductor; PRICE: None; SNAPEDA_LINK: https://www.snapeda.com/parts/1SMA5927BT3G/Onsemi/view-part/?ref=snap
D27 = USBLC6-2SC6:USBLC6-2SC6: Check availability <https://pricing.snapeda.com/parts/USBLC6-2SC6/STMicroelectronics/view-part?ref=eda>; AVAILABILITY: In Stock; CHECK_PRICES: https://www.snapeda.com/parts/USBLC6-2SC6/STMicroelectronics/view-part/?ref=eda; DESCRIPTION: 17V Clamp 5A (8/20µs) Ipp Tvs Diode Surface Mount SOT-23-6; MF: STMicroelectronics; MP: USBLC6-2SC6; PACKAGE: SOT-23-6 STMicroelectronics; PRICE: None; SNAPEDA_LINK: https://www.snapeda.com/parts/USBLC6-2SC6/STMicroelectronics/view-part/?ref=snap
D30_RL1 D30_RL2 D31_TR1 D31_TR2 D56 = B5819W:B5819W: Check availability <https://pricing.snapeda.com/parts/B5819W/Microdiode%20Electronics/view-part?ref=eda>; AVAILABILITY: In Stock; CHECK_PRICES: https://www.snapeda.com/parts/B5819W/Applied+Avionics/view-part/?ref=eda; DESCRIPTION: Rectifier Diode Schottky 40V 1A 2-Pin SOD-123; MF: Microdiode Electronics; MP: B5819W; PACKAGE: None; PRICE: None; SNAPEDA_LINK: https://www.snapeda.com/parts/B5819W/Applied+Avionics/view-part/?ref=snap
D35 D53-D55 = BAT54S:BAT54S: Check availability <https://pricing.snapeda.com/parts/BAT54S/ON%20Semiconductor/view-part?ref=eda>; AVAILABILITY: Not in stock; CHECK_PRICES: https://www.snapeda.com/parts/BAT54S/Onsemi/view-part/?ref=eda; DESCRIPTION: Diode Array 1 Pair Series Connection Schottky 30 V 200mA (DC) Surface Mount TO-236-3, SC-59, SOT-23-3; MF: ON Semiconductor; MP: BAT54S; PACKAGE: SOT-23-3 ON Semiconductor; PRICE: None; SNAPEDA_LINK: https://www.snapeda.com/parts/BAT54S/Onsemi/view-part/?ref=snap
D36 = dp_devices.v6:ZENER: Zener Diode SOD-323
D46 D50 = diode:SUPPRESSOR-: Suppressor diode
F1_RL1 F1_RL2 F2_TR1 F2_TR2 F3 = polyfuse-smd_10:?: Polyfuse Resettable PTC Source: http://www.littelfuse.com/products/resettable-ptcs.aspx; MF: Littelfuse; MPN: 1206L050; OC_FARNELL: 1596993; OC_NEWARK: 53M6118
FID1-FID3 = Fiducial:FID: Fiducial marks. Top and Bottom copper with stop mask
J1 = 16P_smd_header:16P_HEADER_SMD
J2 = openbuilds-eagle-library:CONNECTOR-M3
J3 = jt-con-phoenix-3.81:MC1.5/2
J4-J8 J15 = B4B-XH-A_LF__SN_:B4B-XH-A(LF)(SN): Check availability <https://pricing.snapeda.com/parts/B4B-XH-A%20%28LF%29%28SN%29/JST%20Sales/view-part?ref=eda>; AVAILABILITY: In Stock; CHECK_PRICES: https://www.snapeda.com/parts/B4B-XH-A%20(LF)(SN)/JST/view-part/?ref=eda; DESCRIPTION: Connector Header Through Hole 4 position 0.098 (2.50mm); MF: JST Sales; MP: B4B-XH-A (LF)(SN); PACKAGE: None; PRICE: None; SNAPEDA_LINK: https://www.snapeda.com/parts/B4B-XH-A%20(LF)(SN)/JST/view-part/?ref=snap
J9 = 1803455:1803455: Check availability <https://pricing.snapeda.com/parts/1803455/Phoenix%20Contact/view-part?ref=eda>; AVAILABILITY: In Stock; CHECK_PRICES: https://www.snapeda.com/parts/1803455/Phoenix+Contact/view-part/?ref=eda; DESCRIPTION: Pluggable Header 3.81mm 16AWG 160V 8A 5 Position COMBICON MCV Series | Phoenix Contact 1803455; MF: Phoenix Contact; MP: 1803455; PACKAGE: None; PRICE: None; SNAPEDA_LINK: https://www.snapeda.com/parts/1803455/Phoenix+Contact/view-part/?ref=snap
J10 = DB2EVC-3.81-4P-GN:DB2EVC-3.81-4P-GN: Check availability <https://pricing.snapeda.com/parts/1803439/Phoenix%20Contact/view-part?ref=eda>; AVAILABILITY: In Stock; CHECK_PRICES: https://www.snapeda.com/parts/1803439/Phoenix+Contact/view-part/?ref=eda; DESCRIPTION: Pluggable Header 3.81mm 16AWG 160V 8A 3 Position COMBICON MCV Series | Phoenix Contact 1803439; MF: Phoenix Contact; MP: 1803439; PACKAGE: None; PRICE: None; SNAPEDA_LINK: https://www.snapeda.com/parts/1803439/Phoenix+Contact/view-part/?ref=snap
J11 = 1803280:1803280: Check availability <https://pricing.snapeda.com/parts/1803280/Phoenix%20Contact/view-part?ref=eda>; AVAILABILITY: In Stock; CHECK_PRICES: https://www.snapeda.com/parts/1803280/Phoenix+Contact/view-part/?ref=eda; DESCRIPTION: Pluggable Header 3.81mm 16AWG 160V 8A 3 Position COMBICON MC Series | Phoenix Contact 1803280; MF: Phoenix Contact; MP: 1803280; PACKAGE: None; PRICE: None; SNAPEDA_LINK: https://www.snapeda.com/parts/1803280/Phoenix+Contact/view-part/?ref=snap
J12 J14 = KH-PCB-6P6C:KH-PCB-6P6C: Check availability <https://pricing.snapeda.com/parts/CRJ030-G-TH/Same%20Sky/view-part?ref=eda>; AVAILABILITY: In Stock; CHECK_PRICES: https://www.snapeda.com/parts/CRJ030-G-TH/Same+Sky/view-part/?ref=eda; DESCRIPTION: 6P6C, Single Port, Horizontal, Unshielded, No LED, Through Hole, RJ12 Modular Connector; MF: Same Sky; MP: CRJ030-G-TH; PACKAGE: None; PRICE: None; SNAPEDA_LINK: https://www.snapeda.com/parts/CRJ030-G-TH/Same+Sky/view-part/?ref=snap
J13 J17 P1-P4 P6 P18_RL1 P18_RL2 P19 P21_TR1 P21_TR2 P28 = DB2EVC-3.81-2P-GN:DB2EVC-3.81-2P-GN: Check availability <https://pricing.snapeda.com/parts/691321300002/W%C3%BCrth%20Elektronik/view-part?ref=eda>; AVAILABILITY: In Stock; CHECK_PRICES: https://www.snapeda.com/parts/691321300002/W%25C3%25BCrth+Elektronik+Midcom/view-part/?ref=eda; DESCRIPTION: 321; 3.81mm Pitch Straight Pluggable Term Block, PCB Header, Through Hole, 2 Way | Wurth Electronics 691321300002; MF: Würth Elektronik; MP: 691321300002; PACKAGE: None; PRICE: None; SNAPEDA_LINK: https://www.snapeda.com/parts/691321300002/W%25C3%25BCrth+Elektronik+Midcom/view-part/?ref=snap
J18 J21 = B3B-XH-A_LF__SN_:B3B-XH-A(LF)(SN): Check availability <https://pricing.snapeda.com/parts/B3B-XH-A%28LF%29%28SN%29/JST%20Sales/view-part?ref=eda>; AVAILABILITY: In Stock; CHECK_PRICES: https://www.snapeda.com/parts/B3B-XH-A(LF)(SN)/JST/view-part/?ref=eda; DESCRIPTION: Connector Header Through Hole 3 position 0.098 (2.50mm); MF: JST Sales; MP: B3B-XH-A(LF)(SN); PACKAGE: None; PRICE: None; SNAPEDA_LINK: https://www.snapeda.com/parts/B3B-XH-A(LF)(SN)/JST/view-part/?ref=snap
J19 P5 P23 P25 P26 = pinhead:PINHD-1X2: PIN HEADER
J20 = SparkFun-Connectors:USB_C: USB Type C 16Pin Connector Super Speed pins not available on the 16-pin purely SMD connector so this part is best for USB 2.0 implementations. D1 and D2 are tied together enabling D+/- no matter which way the cable is plugged into the connector. The two channel configuration pins (CC1/2) are exposed. These are normally connected to ground via 5.1k resistors but can be reconfigured for high current/high power applications.; PROD_ID: CONN-14122
K1_TR1 K1_TR2 = TLP3109A:TLP3109A; A1_MIN: 0.0; A_MAX: 2.1; A_MIN: 2.1; A_NOM: 2.1; B_MAX: 0.5; B_MIN: 0.3; B_NOM: 0.4; D2_MAX: 0.0; D_MAX: 6.55; D_MIN: 6.05; D_NOM: 6.3; E1_MAX: 4.65; E1_MIN: 4.15; E1_NOM: 4.4; E2_MAX: 0.0; ENOM: 2.54; E_MAX: 7.4; E_MIN: 6.6; E_NOM: 7.0; L_MAX: 0.9; L_MIN: 0.3; L_NOM: 0.6; MANUFACTURER: Toshiba Semiconductor; PIN_COUNT: 6.0; SNAPEDA_PACKAGE_ID: 60487; STANDARD: IPC 7351B
K2 = VCF4-1000:VCF4-1000: Check availability <https://pricing.snapeda.com/parts/VCF4-1000/TE%20Connectivity/view-part?ref=eda>; AVAILABILITY: In Stock; CHECK_PRICES: https://www.snapeda.com/parts/VCF4-1000/TE+Connectivity+Potter+%2526+Brumfield+Relays/view-part/?ref=eda; COMMENT: 1393310-3; DESCRIPTION: Socket, Relay; PCB, VTF Series, 1 Pole, Quick-Connect, w/o Grounding Provision; MF: TE Connectivity; MP: VCF4-1000; PACKAGE: None; PRICE: None; SNAPEDA_LINK: https://www.snapeda.com/parts/VCF4-1000/TE+Connectivity+Potter+%2526+Brumfield+Relays/view-part/?ref=snap
L1 L2 L7-L12 = dp_devices.v6:FERRITE: Ferrite bead in various packages; LCSC_PART: C139188
L3 = YJYCOIN YSPI0630A-220M:YSPI0630A-220M: Check availability <https://pricing.snapeda.com/parts/AMPLA7030S220MT/Abracon/view-part?ref=eda>; AVAILABILITY: In Stock; CHECK_PRICES: https://www.snapeda.com/parts/AMPLA7030S220MT/Abracon/view-part/?ref=eda; DESCRIPTION: INDUCTOR, 22UH, SHIELDED, 2A; Inductance:22µH; RMS Current (Irms):2A; Inductor Construction:Shielded; Saturation Current (Isat):3.5A; Product Range:AMPLA7030S Series; Power Inductor Case:7.3mm x 6.6mm x 2.8mm RoHS Compliant: Yes; MF: Abracon; MP: AMPLA7030S220MT; PACKAGE: Package; PRICE: None; SNAPEDA_LINK: https://www.snapeda.com/parts/AMPLA7030S220MT/Abracon/view-part/?ref=snap
L4 L6 = dp_devices.v6:FERRITE: Ferrite bead in various packages
L5 = inductors:DR125: High Power Density, High Efficiency, Shielded Inductors Source: coiltronics_dr_series.pdf; SPICEPREFIX: L
L13 = DLW21HN900SQ2L:DLW21HN900SQ2L: Check availability <https://pricing.snapeda.com/parts/DLW21HN900SQ2L/Murata/view-part?ref=eda>; AVAILABILITY: In Stock; CHECK_PRICES: https://www.snapeda.com/parts/DLW21HN900SQ2L/Murata/view-part/?ref=eda; DESCRIPTION: 2 Line Common Mode Choke Surface Mount 90 Ohms @ 100 MHz 330mA DCR 350mOhm; MF: Murata; MP: DLW21HN900SQ2L; PACKAGE: Horizontal-4 Murata; PRICE: None; SNAPEDA_LINK: https://www.snapeda.com/parts/DLW21HN900SQ2L/Murata/view-part/?ref=snap
P8 = pinhead:PINHD-1X5: PIN HEADER
P9 = pinhead:PINHD-1X4: PIN HEADER
P10 = con-phoenix-508:MSTBA2: PHOENIX; MF: FARNELL; MPN: 1757242; OC_FARNELL: 3705171; OC_NEWARK: 71C4161
P11 = shrouded_box_headers:SHROUDED_BOX_HEADER_40: Check availability <https://pricing.snapeda.com/parts/SBH11PBPCD07STBK/Sullins%20Connector%20Solutions/view-part?ref=eda>
P12 = HR911105A:HR911105A: Check availability <https://pricing.snapeda.com/parts/HR911105A/hanrun/view-part?ref=eda>; AVAILABILITY: In Stock; CHECK_PRICES: https://www.snapeda.com/parts/HR911105A/HanRun/view-part/?ref=eda; MF: hanrun; MP: HR911105A; PACKAGE: None; PRICE: None; SNAPEDA_LINK: https://www.snapeda.com/parts/HR911105A/HanRun/view-part/?ref=snap
P13 P14 P16 P20 P27 = shrouded_box_headers:SHROUDED_BOX_HEADER_08: Check availability <https://pricing.snapeda.com/parts/SBH11PBPCD07STBK/Sullins%20Connector%20Solutions/view-part?ref=eda>
P15 = Eagle_BOARD-TO-BOARD_CONNECTORS (rev18b):621X1021021: WR-PHD 1.27mm Dual SMT Pin Header H=3.80 mm, 10 Pins=>Code : Con_BTB_PHD_1.27_2_621x1021021(Packaging:x = 0: Tube x = 3: Tape & Reel with Cap) <http://katalog.we-online.de/media/thumbs2/eican/thb_Con_BTB_PHD_1.27_2_6210xx21021_pf2.jpg> 6210xx21021 Details see: http://katalog.we-online.de/en/em/621_0xx_210_21 6213xx21021 Details see: http://katalog.we-online.de/en/em/PHD_1_27_SMT_DUAL_PIN_HEADER_REEL_6213XX21021 2014 (C) Würth Elektronik
P17 = 1803471:1803471: Check availability <https://pricing.snapeda.com/parts/1803471/Phoenix%20Contact/view-part?ref=eda>; AVAILABILITY: In Stock; CHECK_PRICES: https://www.snapeda.com/parts/1803471/Phoenix+Contact/view-part/?ref=eda; DESCRIPTION: Pluggable Header 3.81mm 16AWG 160V 8A 7 Position COMBICON MCV Series | Phoenix Contact 1803471; MF: Phoenix Contact; MP: 1803471; PACKAGE: None; PRICE: None; SNAPEDA_LINK: https://www.snapeda.com/parts/1803471/Phoenix+Contact/view-part/?ref=snap
P24 = 1803329:1803329: Check availability <https://pricing.snapeda.com/parts/1803329/Phoenix%20Contact/view-part?ref=eda>; AVAILABILITY: In Stock; CHECK_PRICES: https://www.snapeda.com/parts/1803329/Phoenix+Contact/view-part/?ref=eda; DESCRIPTION: Pluggable Header 3.81mm 16AWG 160V 8A 7 Position COMBICON MC Series | Phoenix Contact 1803329; MF: Phoenix Contact; MP: 1803329; PACKAGE: None; PRICE: None; SNAPEDA_LINK: https://www.snapeda.com/parts/1803329/Phoenix+Contact/view-part/?ref=snap
Q1 = transistor-fet:FDD4141: P-Channel PowerTrench® MOSFET Source: FDD4141.pdf
Q2_RL1 Q2_RL2 Q13 = mosfet:ST3422A: Nch MOSFET IRLML6344 30V 5A http://akizukidenshi.com/catalog/g/gI-06049/ I-06049
Q3-Q8 Q9_TR1 Q9_TR2 Q10_RL1 Q10_RL2 Q11 Q12 = mosfet:2N7002-7-F: Nch MOSFET IRLML6344 30V 5A http://akizukidenshi.com/catalog/g/gI-06049/ I-06049
Q14 Q15 = CSD19538Q3A:CSD19538Q3A
Q16 Q17 = BSS123TA:BSS123TA: Check availability <https://pricing.snapeda.com/parts/BSS123TA/Diodes%20Inc./view-part?ref=eda>; AVAILABILITY: In Stock; CHECK_PRICES: https://www.snapeda.com/parts/BSS123TA/Diodes+Inc./view-part/?ref=eda; DESCRIPTION: MOSFET N-Channel 100V 0.17A SOT23 | Diodes Inc BSS123TA; MF: Diodes Inc.; MP: BSS123TA; PACKAGE: SOT-23 Diodes Inc.; PRICE: None; SNAPEDA_LINK: https://www.snapeda.com/parts/BSS123TA/Diodes+Inc./view-part/?ref=snap
R1-R21 R22_AL R22_CY R22_DR R22_HL R22_MC1 R22_MC2 R22_PRB R22_TLO R22_XL R22_Y1L R22_Y2L R22_ZL R23_AL R23_CY R23_DR R23_HL R23_MC1 R23_MC2 R23_PRB R23_TLO R23_XL R23_Y1L R23_Y2L R23_ZL R24-R32 R33_TR1 R33_TR2 R34-R38 R39_TR1 R39_TR2 R40-R70 R72 R74-R76 R77_AO0 R77_AO1-R77_AO3 R77_COO R77_MIS R78-R88 R89_RL1 R89_RL2 R90-R103 R105_RL1 R105_RL2 R106-R108 R109_RL1 R109_RL2 R110-R120 R121_AO0 R121_AO1-R121_AO3 R121_COO R121_MIS R122_AO0 R122_AO1-R122_AO3 R122_COO R122_MIS R123_N0 R123_N1-R123_N3 R124_N0 R124_N1-R124_N3 R125-R137 R139-R158 R160-R173 R174_TR1 R174_TR2 R175-R213 R215 = rcl:R-EU_: RESISTOR, European symbol; SPICEPREFIX: R
R104 R159 = ptc-ntc:B57164: SIEMENS NTC; MPN: B57164K474K52; OC_FARNELL: 9753451; OC_NEWARK: 29M3118
S1 = XKB Enterprise SS-12D11G5R:XKBENTERPRISESS-12D11G5R
SD3 = sd-mmc:TF-HOLDER: TF / Micro SD socket is PUSH-PUSH type, the card can be pushed into and auto locked and pushed out by simply press the card. Surface Mounting type.
TP1-TP7 TP9 TP11 TP13-TP24 TP26 TP28 TP31-TP61 = testpad:TP: Test pad
U1 = SN74AHC1G86DBVR:SN74AHC1G86DBVR: Check availability <https://pricing.snapeda.com/parts/SN74AHC1G86DBVR/Texas%20Instruments/view-part?ref=eda>; AVAILABILITY: In Stock; CHECK_PRICES: https://www.snapeda.com/parts/SN74AHC1G86DBVR/Texas+Instruments/view-part/?ref=eda; DESCRIPTION: Single 2-input, 2-V to 5.5-V XOR (exclusive OR) gate; MF: Texas Instruments; MP: SN74AHC1G86DBVR; PACKAGE: SOT-23-5 Texas Instruments; PRICE: None; SNAPEDA_LINK: https://www.snapeda.com/parts/SN74AHC1G86DBVR/Texas+Instruments/view-part/?ref=snap
U2_AL U2_CY U2_DR U2_HL U2_MC1 U2_MC2 U2_PRB U2_TLO U2_XL U2_Y1L U2_Y2L U2_ZL U4-U8 U10 U15 U21-U23 U29-U32 U33_AO0 U33_AO1-U33_AO3 U33_COO U33_MIS U34_N0 U34_N1-U34_N3 U39 U43 U47-U49 = EL357N-G:EL357N-G: Check availability <https://pricing.snapeda.com/parts/EL357N-G/Everlight%20Electronics/view-part?ref=eda>; AVAILABILITY: In Stock; CHECK_PRICES: https://www.snapeda.com/parts/EL357N-G/Everlight/view-part/?ref=eda; DESCRIPTION: Optoisolator Transistor Output 3750Vrms 1 Channel 4-SOP (2.54mm); MF: Everlight Electronics; MP: EL357N-G; PACKAGE: SOP-4 Everlight; PRICE: None; SNAPEDA_LINK: https://www.snapeda.com/parts/EL357N-G/Everlight/view-part/?ref=snap
U3 = SN74LVC2G17DBVR:SN74LVC2G17DBVR: Check availability <https://pricing.snapeda.com/parts/SN74LVC2G17DBVR/Texas%20Instruments/view-part?ref=eda>; AVAILABILITY: In Stock; CHECK_PRICES: https://www.snapeda.com/parts/SN74LVC2G17DBVR/Texas+Instruments/view-part/?ref=eda; DESCRIPTION: 2-ch, 1.65-V to 5.5-V buffers with Schmitt-Trigger inputs; MF: Texas Instruments; MP: SN74LVC2G17DBVR; PACKAGE: SOT-23-6 Texas Instruments; PRICE: None; SNAPEDA_LINK: https://www.snapeda.com/parts/SN74LVC2G17DBVR/Texas+Instruments/view-part/?ref=snap
U9 U36 = AM26LS31CDR:AM26LS31CDR: Check availability <https://pricing.snapeda.com/parts/AM26LS31CDR/Texas%20Instruments/view-part?ref=eda>; AVAILABILITY: In Stock; CHECK_PRICES: https://www.snapeda.com/parts/AM26LS31CDR/Texas+Instruments/view-part/?ref=eda; DESCRIPTION: Quadruple differential line driver; MF: Texas Instruments; MP: AM26LS31CDR; PACKAGE: SOIC-16 Texas Instruments; PRICE: None; SNAPEDA_LINK: https://www.snapeda.com/parts/AM26LS31CDR/Texas+Instruments/view-part/?ref=snap
U11 = W5500 (1):W5500: Check availability <https://pricing.snapeda.com/parts/W5500/WIZnet/view-part?ref=eda>; AVAILABILITY: In Stock; CHECK_PRICES: https://www.snapeda.com/parts/W5500/WIZnet/view-part/?ref=eda; DESCRIPTION: Ethernet Controller 10/100 Base-T/TX PHY SPI Interface 48-LQFP (7x7); MF: WIZnet; MP: W5500; PACKAGE: LQFP-48 WIZnet; PRICE: None; SNAPEDA_LINK: https://www.snapeda.com/parts/W5500/WIZnet/view-part/?ref=snap
U12 U18 U20 = CBMuD1201LAS8:CBMUD1201LAS8
U13 = SN75176BDR:SN75176BDR: Check availability <https://pricing.snapeda.com/parts/SN75176BDR/Texas%20Instruments/view-part?ref=eda>; AVAILABILITY: In Stock; CHECK_PRICES: https://www.snapeda.com/parts/SN75176BDR/Texas+Instruments/view-part/?ref=eda; DESCRIPTION: Differential bus transceiver; MF: Texas Instruments; MP: SN75176BDR; PACKAGE: SOIC-8 Texas Instruments; PRICE: None; SNAPEDA_LINK: https://www.snapeda.com/parts/SN75176BDR/Texas+Instruments/view-part/?ref=snap
U14 U26 U27 U37 U38 U45 U46 = ADUM1200ARZ-RL7:ADUM1200ARZ-RL7: Check availability <https://pricing.snapeda.com/parts/ADUM1200ARZRL7/Analog%20Devices/view-part?ref=eda>; AVAILABILITY: In Stock; CHECK_PRICES: https://www.snapeda.com/parts/ADUM1200ARZRL7/Analog+Devices/view-part/?ref=eda; DESCRIPTION: General Purpose Digital Isolator 2500Vrms 2 Channel 1Mbps 25kV/µs CMTI 8-SOIC (0.154, 3.90mm Width); MF: Analog Devices; MP: ADUM1200ARZRL7; PACKAGE: None; PRICE: None; SNAPEDA_LINK: https://www.snapeda.com/parts/ADUM1200ARZRL7/Analog+Devices/view-part/?ref=snap
U16 = TPS54331DR:TPS54331DR: Check availability <https://pricing.snapeda.com/parts/TPS54331DR/Texas%20Instruments/view-part?ref=eda>; AVAILABILITY: In Stock; CHECK_PRICES: https://www.snapeda.com/parts/TPS54331DR/Texas+Instruments/view-part/?ref=eda; DESCRIPTION: 3.5V to 28V Input, 3A, 570kHz Step-Down Converter with Eco-mode; MF: Texas Instruments; MP: TPS54331DR; PACKAGE: SOIC-8 Texas Instruments; PRICE: None; SNAPEDA_LINK: https://www.snapeda.com/parts/TPS54331DR/Texas+Instruments/view-part/?ref=snap
U17 = stm32f412:STM32F412VGT6: STM32F412VGT6 LQFP-100(14x14) Microcontroller Units (MCUs/MPUs/SOCs) ROHS LCSC C727951; LCSC_PART: C727951
U19 = micro-philips:PCA82C250: CAN CONTROLLER INTERFACE; OC_FARNELL: 1085275; OC_NEWARK: unknown
U24 = LM5146QRGYTQ1:LM5146QRGYTQ1; COPYRIGHT: Copyright (C) 2025 Ultra Librarian. All rights reserved.; DATASHEET: https://www.ti.com/lit/gpn/lm5146-q1; DESCRIPTION: Automotive 100-V synchronous buck DC/DC controller with wide duty-cycle range 20-VQFN -40 to 150; MANUFACTURER_NAME: Texas Instruments; MANUFACTURER_PART_NUMBER: LM5146QRGYTQ1; REFDES: RefDes; TYPE: TYPE
U25 = 74LVC1G08GW-Q100_1:74LVC1G08GW-Q100,1: Check availability <https://pricing.snapeda.com/parts/74LVC1G08GW-Q100%2C1/Nexperia%20USA/view-part?ref=eda>; AVAILABILITY: In Stock; CHECK_PRICES: https://www.snapeda.com/parts/74LVC1G08GW-Q100,1/Nexperia/view-part/?ref=eda; DESCRIPTION: AND Gate IC 1 Channel - 5-TSSOP; MF: Nexperia USA; MP: 74LVC1G08GW-Q100,1; PACKAGE: TSSOP5-5 Nexperia USA Inc.; PRICE: None; SNAPEDA_LINK: https://www.snapeda.com/parts/74LVC1G08GW-Q100,1/Nexperia/view-part/?ref=snap
U28 = SparkFun-LED:WS2812B: WS2812B SMD addressable RGB LED 5x5mm SMD LED with built-in controller IC. Color: Red/Green/Blue mC Rating: RGB: 390, 660, 180 mcd Forward Voltage: RGB: 2.0, 3.0, 3.0 V Packages:WS2812B SparkFun Products: Blynk Board - ESP8266 <https://www.sparkfun.com/products/13794>; PROD_ID: DIO-12503
U35 = microchip:24*: Serial EEPROM I2C; MF: RAMTRON INTERNATIONAL CORP; MPN: FM24C64-S; OC_FARNELL: 9882685; OC_NEWARK: 98H0189
U40 = LM393DR2G:LM393DR2G: Check availability <https://pricing.snapeda.com/parts/LM393DR2G/ON%20Semiconductor/view-part?ref=eda>; AVAILABILITY: In Stock; CHECK_PRICES: https://www.snapeda.com/parts/LM393DR2G/Onsemi/view-part/?ref=eda; DESCRIPTION: Comparator General Purpose CMOS, DTL, ECL, MOS, Open-Collector, TTL 8-SOIC; MF: ON Semiconductor; MP: LM393DR2G; PACKAGE: SOIC-8 ON Semiconductor; PRICE: None; SNAPEDA_LINK: https://www.snapeda.com/parts/LM393DR2G/Onsemi/view-part/?ref=snap
U41 = INA280A3IDCKR:INA280A3IDCKR; COPYRIGHT: Copyright (C) 2025 Ultra Librarian. All rights reserved.; DATASHEET: https://www.ti.com/lit/gpn/ina280; DESCRIPTION: 2.7-V to 120-V, 1.1-MHz, high-precision current sense amplifier in small (SC-70) package 5-SC70 -40 to 125; MANUFACTURER_NAME: Texas Instruments; MANUFACTURER_PART_NUMBER: INA280A3IDCKR; REFDES: RefDes; TYPE: TYPE
U42 = SN74HC00DR:SN74HC00DR: Check availability <https://pricing.snapeda.com/parts/SN74HC00DR/Texas%20Instruments/view-part?ref=eda>; AVAILABILITY: In Stock; CHECK_PRICES: https://www.snapeda.com/parts/SN74HC00DR/Texas+Instruments/view-part/?ref=eda; DESCRIPTION: 4-ch, 2-input, 2-V to 6-V 5.2 mA drive strength NAND gate; MF: Texas Instruments; MP: SN74HC00DR; PACKAGE: SOIC-14 Texas Instruments; PRICE: None; SNAPEDA_LINK: https://www.snapeda.com/parts/SN74HC00DR/Texas+Instruments/view-part/?ref=snap
U44 = SN74LVC1G32DCKRE4:SN74LVC1G32DCKRE4: Check availability <https://pricing.snapeda.com/parts/SN74LVC1G32DCKRE4/Texas%20Instruments/view-part?ref=eda>; AVAILABILITY: In Stock; CHECK_PRICES: https://www.snapeda.com/parts/SN74LVC1G32DCKRE4/Texas+Instruments/view-part/?ref=eda; DESCRIPTION: Single 2-Input Positive-OR Gate 5-SC70 -40 to 125; MF: Texas Instruments; MP: SN74LVC1G32DCKRE4; PACKAGE: SC70-5 Texas Instruments; PRICE: None; SNAPEDA_LINK: https://www.snapeda.com/parts/SN74LVC1G32DCKRE4/Texas+Instruments/view-part/?ref=snap
U50 = dp_devices.v6:IC_555: Classic 555 IC
VR1 = AMS1117-3.3:AMS1117-3.3: Check availability <https://pricing.snapeda.com/parts/TLV111733CDCY/Texas%20Instruments/view-part?ref=eda>; AVAILABILITY: In Stock; CHECK_PRICES: https://www.snapeda.com/parts/TLV111733CDCY/Texas+Instruments/view-part/?ref=eda; DESCRIPTION: LDO VOLTAGE REGULATOR, 3.3V, 0.8A, SOT-2; Output Type:Fixed; Input Voltage Min:4.7V; Input Voltage Max:15V; Fixed Output Voltage Nom.:3.3V; Adjustable Output Voltage Min:-; Adjustable Output Voltage Max:-; Output Current:800mA; Dropout Voltage Vdo:1.2V; LDO Regulator Case Style:SOT-223; No. of Pins:3Pins; Operating Temperature Min:0°C; Operating Temperature Max:125°C; Product Range:3.3V 800mA LDO Voltage Regulators; MSL:MSL 2 - 1 year; SVHC:No SVHC (15-Jan-2019); Accuracy %:2.5%; Base Number:1117; No. of Outputs:1Outputs; Operating Temperature Range:0°C to +125°C; Operating Voltage Tolerance +:0.2%; Output Current Max:0.8A; Output Voltage Nom.:3.3V; Primary Input Voltage:15V; Supply Voltage Min:2.7V; Termination Type:Surface Mount Device; Voltage Regulator Type:LDO Fixed Positive; MF: Texas Instruments; MP: TLV111733CDCY; PACKAGE: None; PRICE: None; SNAPEDA_LINK: https://www.snapeda.com/parts/TLV111733CDCY/Texas+Instruments/view-part/?ref=snap
Y1 Y3 = TSX-3225_16.0000MF18X-AC3:TSX-3225_16.0000MF18X-AC3: Check availability <https://pricing.snapeda.com/parts/TSX-3225%2016.0000MF18X-AC3/EPSON/view-part?ref=eda>; AVAILABILITY: In Stock; CHECK_PRICES: https://www.snapeda.com/parts/TSX-3225%2016.0000MF18X-AC3/EPSON/view-part/?ref=eda; DESCRIPTION: 16 MHz ±10ppm Crystal 18pF 60 Ohms 4-SMD, No Lead; LCSC_PART: C2682775; MF: EPSON; MP: TSX-3225 16.0000MF18X-AC3; PACKAGE: SMD-4 EPSON; PRICE: None; SNAPEDA_LINK: https://www.snapeda.com/parts/TSX-3225%2016.0000MF18X-AC3/EPSON/view-part/?ref=snap